# EAGLE schematic quantum_AnalougeEngine_V3_0 (EAGLE 9.5.1)

## Sheet 1 of 10: Interface
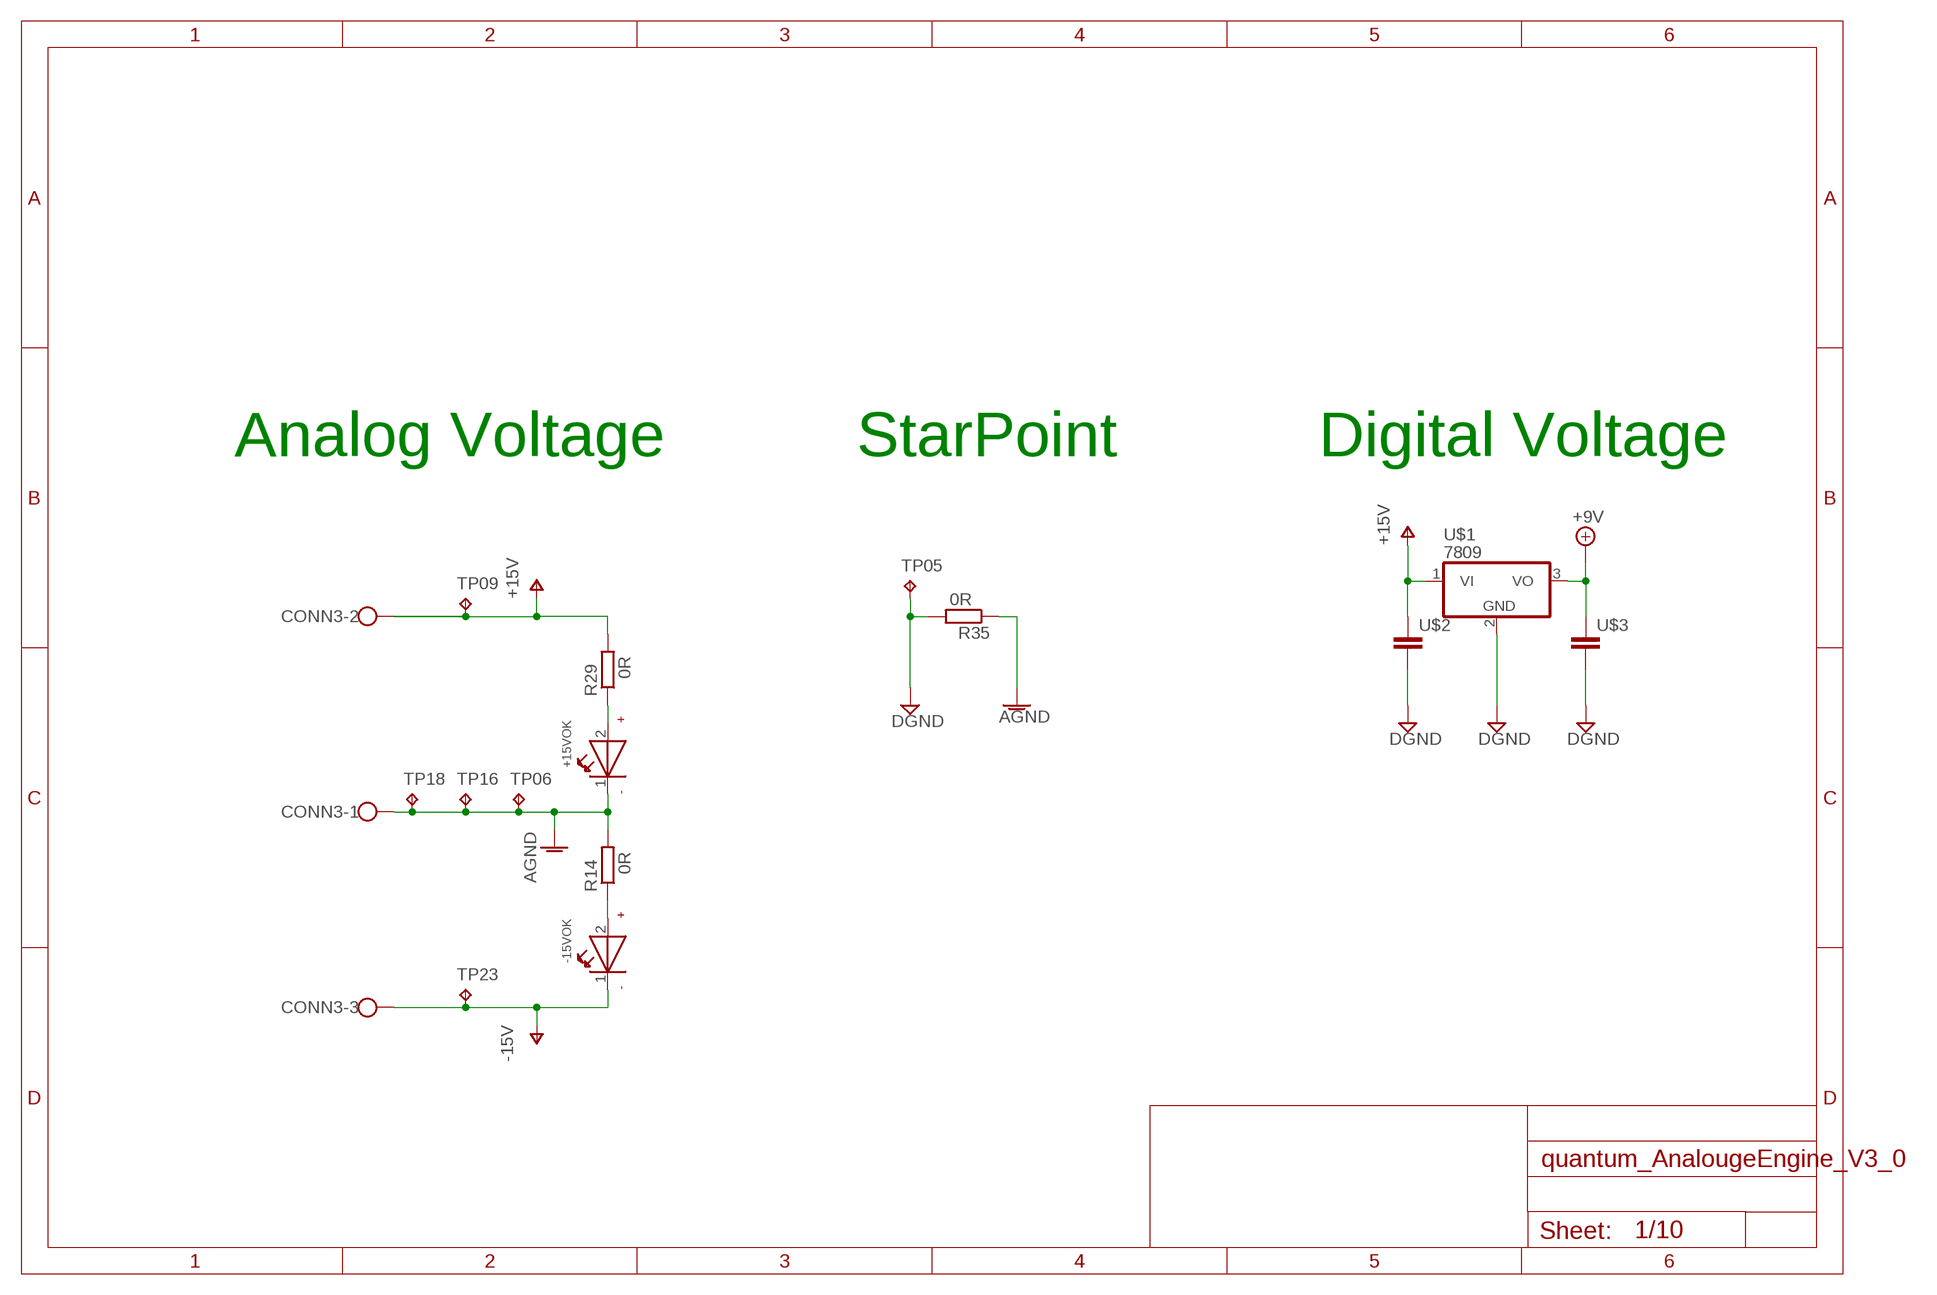
[diagram p0: schematic, sheet 1]

### Parts
+15VOK  SMD_LED_0603  [WL-SMCW_0603]
-15VOK  SMD_LED_0603  [WL-SMCW_0603]
CONN3  SCHRAUBKLEMME_3POL  [W237-103]
R14  0R  RESISTOR"  [R0805]
R29  0R  RESISTOR"  [R0805]
R35  0R  RESISTOR"  [R0805]
TP05  TPTHT  [THT_PIN]
TP06  TPTHT  [THT_PIN]
TP09  TPTHT  [THT_PIN]
TP16  TPTHT  [THT_PIN]
TP18  TPTHT  [THT_PIN]
TP23  TPTHT  [THT_PIN]
U$1  7809  78  [TO252]
U$2  CAPACITOR"  [C0603]
U$3  CAPACITOR"  [C0603]

### Nets
+9V: U$1.3(VO) U$3.1 ; also sheet 2,10
AGND: +15VOK.1(-) CONN3.1 R14.2 R35.1 TP06.P$1(TP) TP16.P$1(TP) TP18.P$1(TP) ; also sheet 3,4,5,6,7,8,9
DGND: R35.2 TP05.P$1(TP) U$1.2(GND) U$2.2 U$3.2 ; also sheet 2,10
N$50: -15VOK.2(+) R14.1
N$52: +15VOK.2(+) R29.1
V+: CONN3.2 R29.2 TP09.P$1(TP) U$1.1(VI) U$2.1 ; supply symbol labelled +15V ; also sheet 3,4,5,6,7,8,9
V-: -15VOK.1(-) CONN3.3 TP23.P$1(TP) ; supply symbol labelled -15V ; also sheet 3,4,5,6,7,8,9

### Notes on the sheet
- Analog Voltage | StarPoint | Digital Voltage

## Sheet 2 of 10: Relais
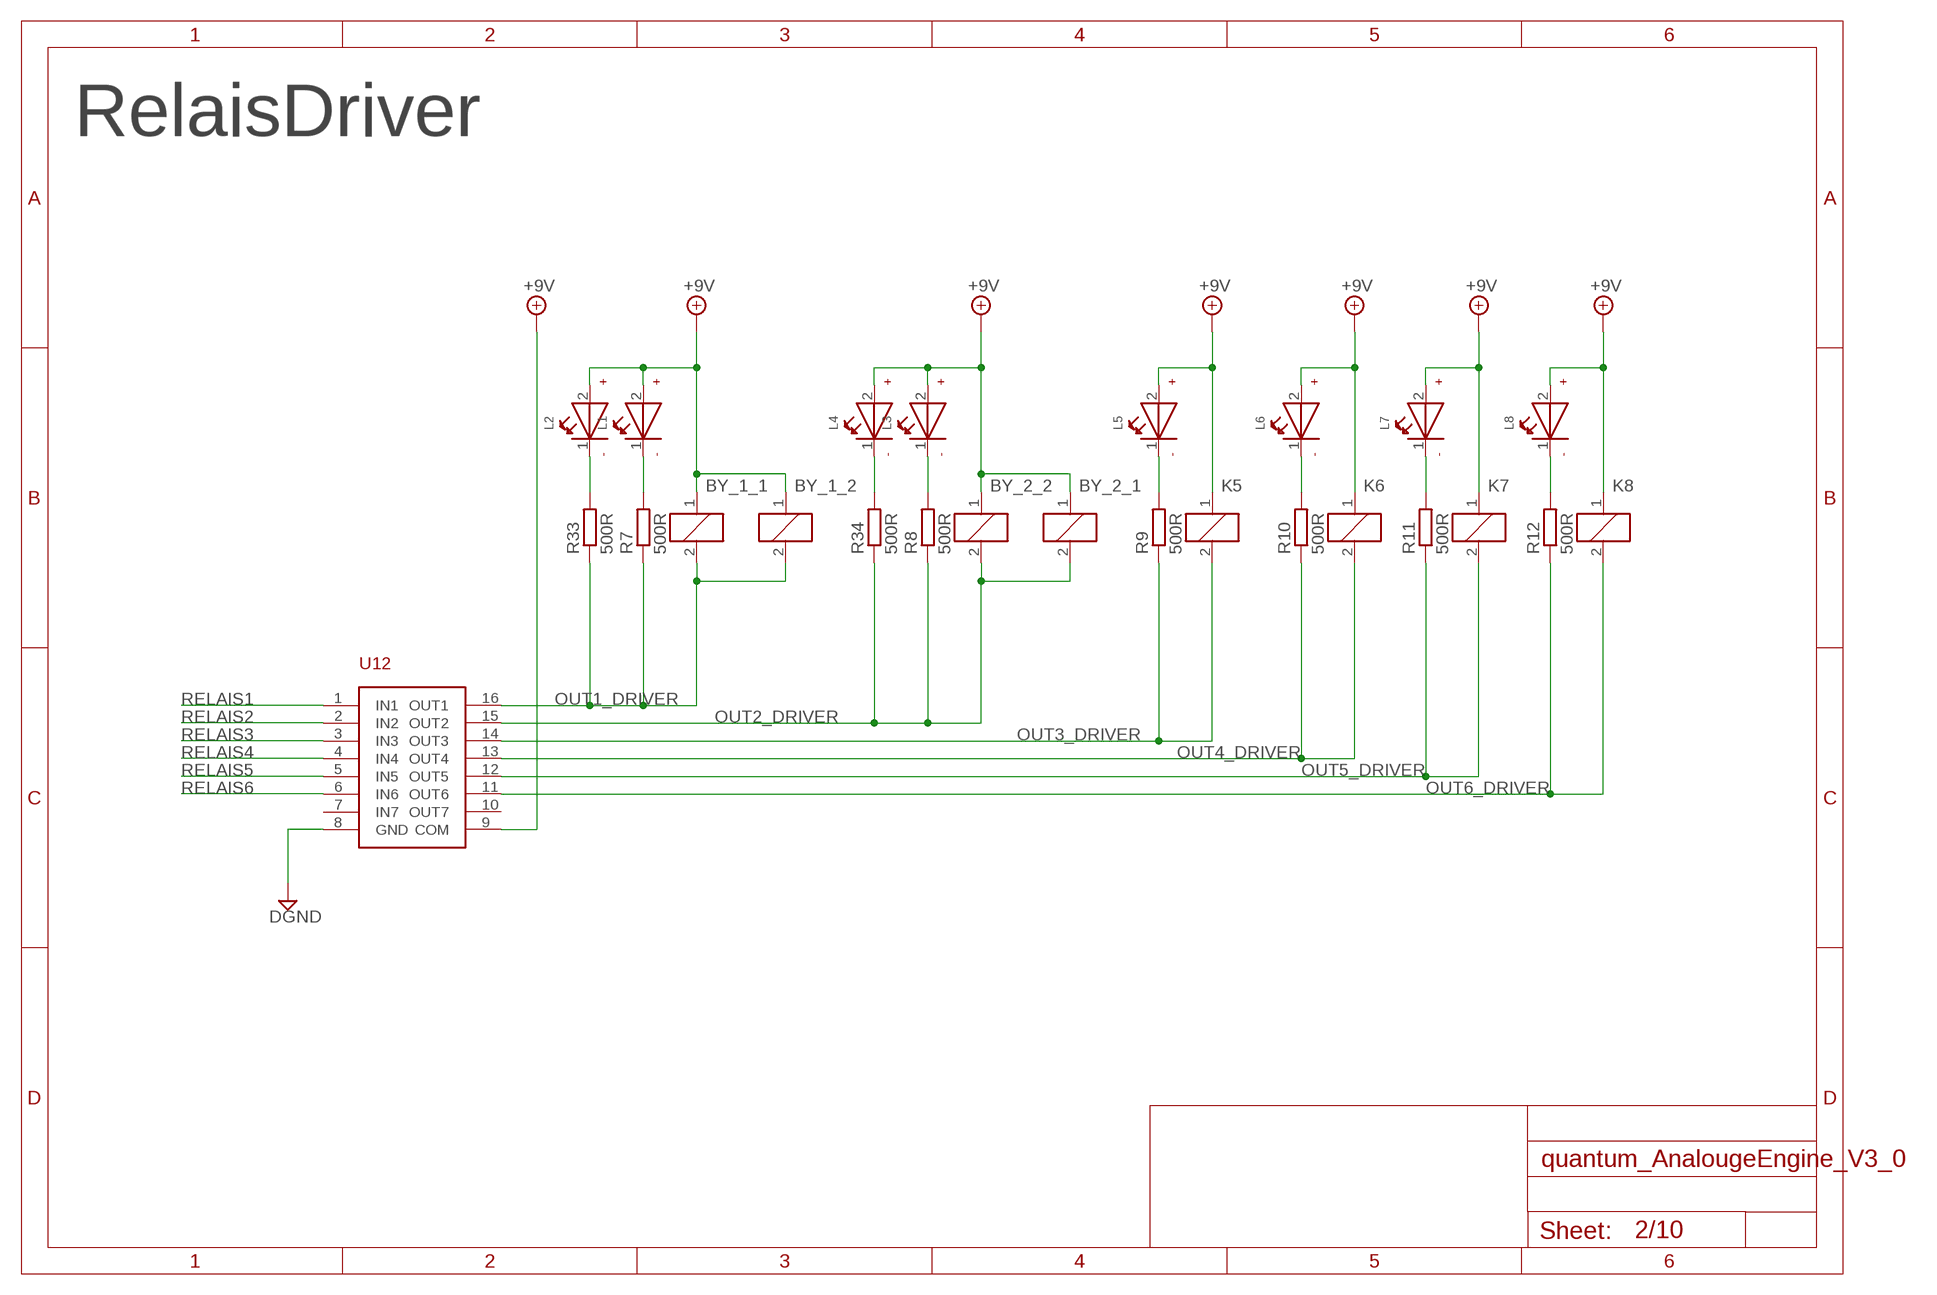
[diagram p1: schematic, sheet 2]

### Parts
BY_1_1  RELAY_EE2-5NU  [351]
BY_1_2  RELAY_EE2-5NU  [351]
BY_2_1  RELAY_EE2-5NU  [351]
BY_2_2  RELAY_EE2-5NU  [351]
K5  RELAY_EE2-5NU  [351]
K6  RELAY_EE2-5NU  [351]
K7  RELAY_EE2-5NU  [351]
K8  RELAY_EE2-5NU  [351]
L1  SMD_LED_0603  [WL-SMCW_0603]
L2  SMD_LED_0603  [WL-SMCW_0603]
L3  SMD_LED_0603  [WL-SMCW_0603]
L4  SMD_LED_0603  [WL-SMCW_0603]
L5  SMD_LED_0603  [WL-SMCW_0603]
L6  SMD_LED_0603  [WL-SMCW_0603]
L7  SMD_LED_0603  [WL-SMCW_0603]
L8  SMD_LED_0603  [WL-SMCW_0603]
R7  500R  RESISTOR"  [R0805]
R8  500R  RESISTOR"  [R0805]
R9  500R  RESISTOR"  [R0805]
R10  500R  RESISTOR"  [R0805]
R11  500R  RESISTOR"  [R0805]
R12  500R  RESISTOR"  [R0805]
R33  500R  RESISTOR"  [R0805]
R34  500R  RESISTOR"  [R0805]
U12  ULN2003  [SOIC16]

### Nets
+9V: BY_1_1.1 BY_1_2.1 BY_2_1.1 BY_2_2.1 K5.1 K6.1 K7.1 K8.1 L1.2(+) L2.2(+) L3.2(+) L4.2(+) L5.2(+) L6.2(+) L7.2(+) L8.2(+) U12.9(COM) ; also sheet 1,10
DGND: U12.8(GND) ; also sheet 1,10
N$14: L1.1(-) R7.2
N$16: L3.1(-) R8.2
N$26: L8.1(-) R12.2
N$29: L7.1(-) R11.2
N$30: L6.1(-) R10.2
N$32: L5.1(-) R9.2
N$49: L2.1(-) R33.2
N$51: L4.1(-) R34.2
OUT1_DRIVER: BY_1_1.2 BY_1_2.2 R7.1 R33.1 U12.16(OUT1)
OUT2_DRIVER: BY_2_1.2 BY_2_2.2 R8.1 R34.1 U12.15(OUT2)
OUT3_DRIVER: K5.2 R9.1 U12.14(OUT3)
OUT4_DRIVER: K6.2 R10.1 U12.13(OUT4)
OUT5_DRIVER: K7.2 R11.1 U12.12(OUT5)
OUT6_DRIVER: K8.2 R12.1 U12.11(OUT6)
RELAIS1: U12.1(IN1) ; also sheet 10
RELAIS2: U12.2(IN2) ; also sheet 10
RELAIS3: U12.3(IN3) ; also sheet 10
RELAIS4: U12.4(IN4) ; also sheet 10
RELAIS5: U12.5(IN5) ; also sheet 10
RELAIS6: U12.6(IN6) ; also sheet 10
Unconnected: U12.7(IN7) U12.10(OUT7)

### Notes on the sheet
- RelaisDriver

## Sheet 3 of 10: MS Decode
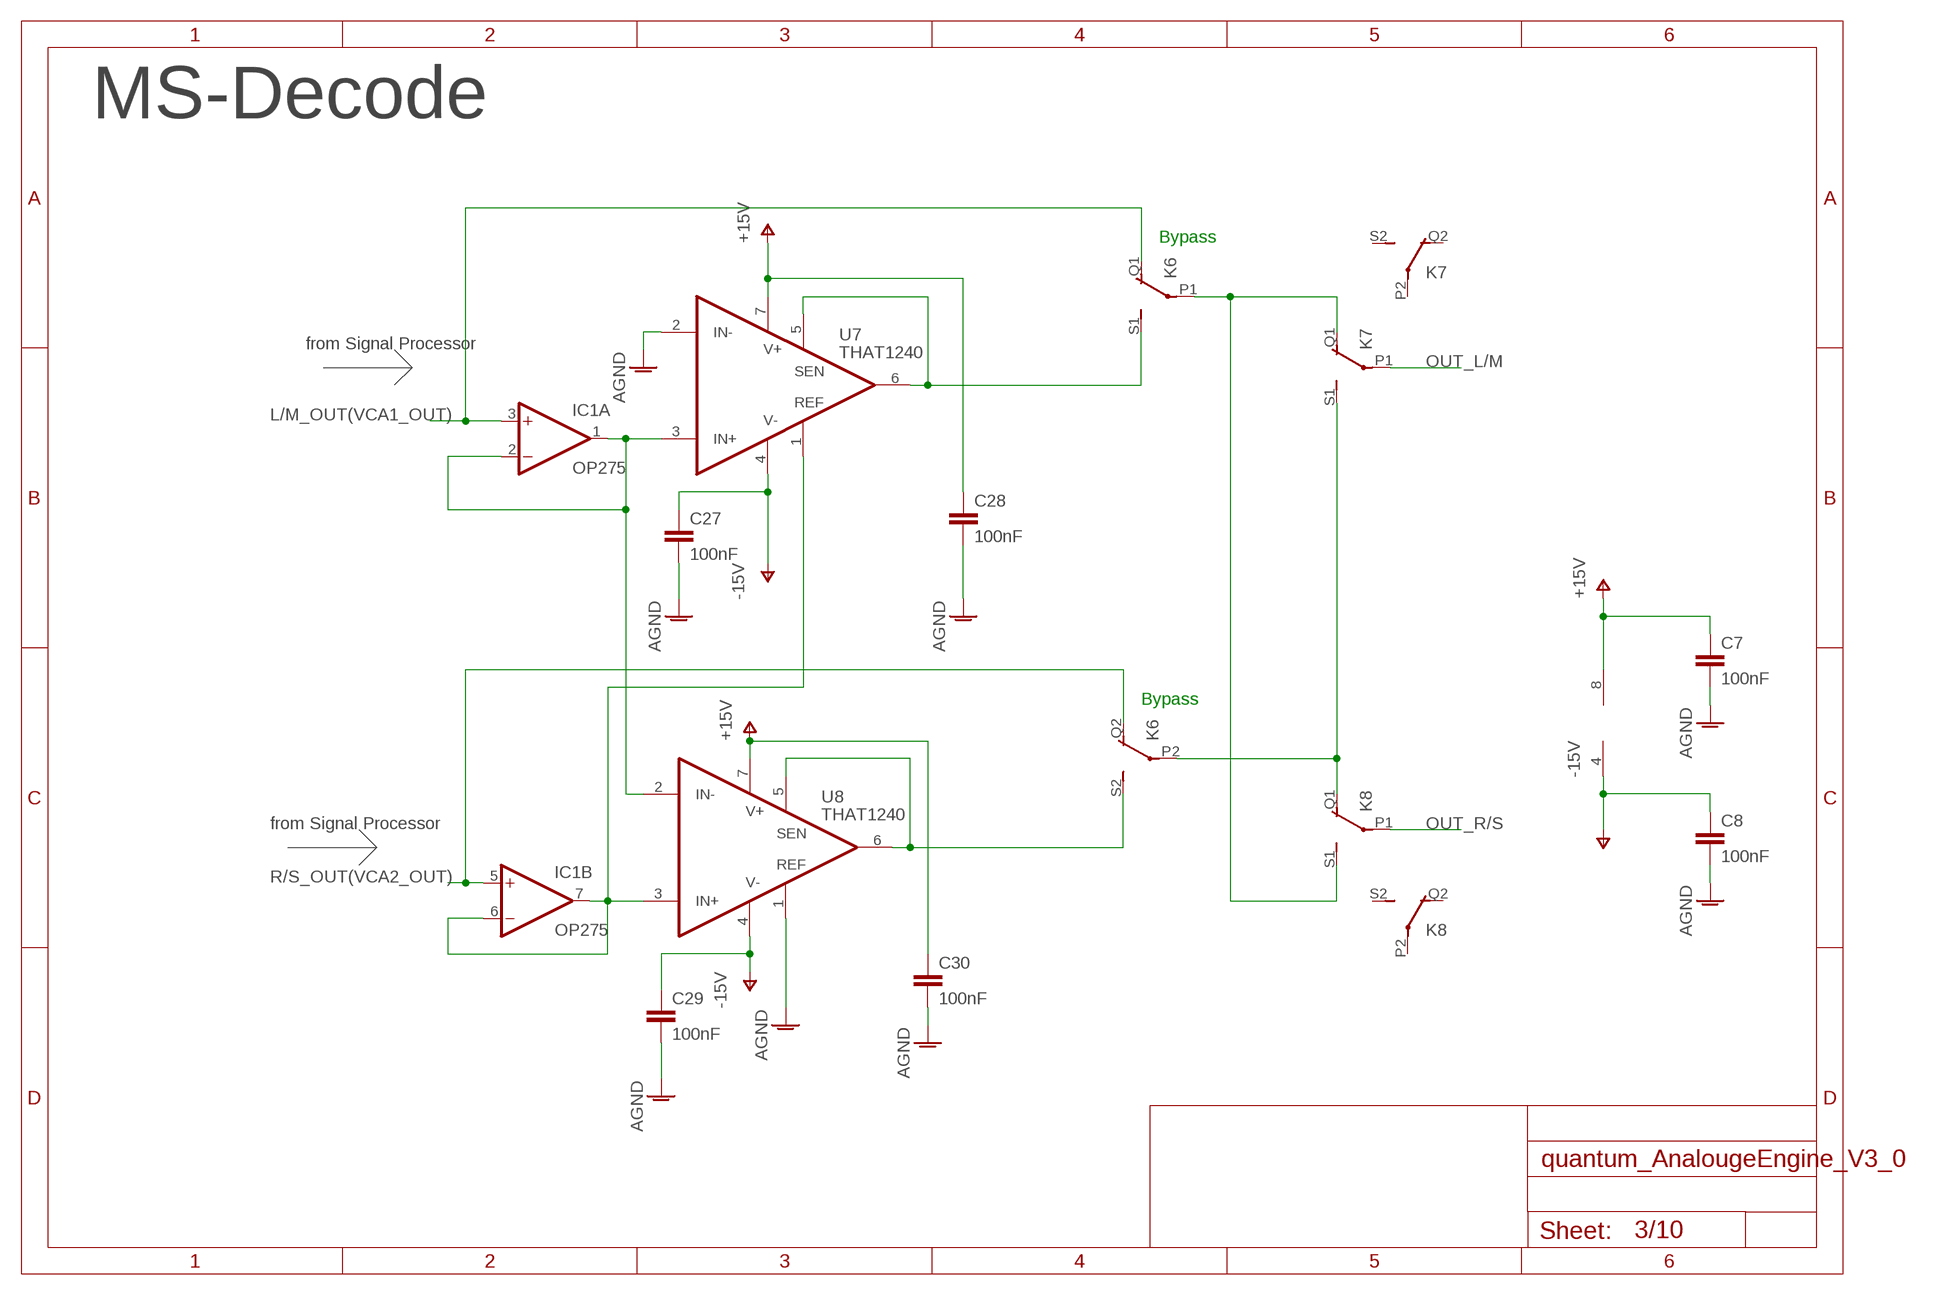
[diagram p2: schematic, sheet 3]

### Parts
C7  100nF  CAPACITOR"  [C0603]
C8  100nF  CAPACITOR"  [C0603]
C27  100nF  CAPACITOR"  [C0603]
C28  100nF  CAPACITOR"  [C0603]
C29  100nF  CAPACITOR"  [C0603]
C30  100nF  CAPACITOR"  [C0603]
IC1  OP275  [SOIC8]
U7  THAT1240  THAT1240SO8-U  [SO08]
U8  THAT1240  THAT1240SO8-U  [SO08]

### Nets
AGND: C7.2 C8.2 C27.2 C28.2 C29.2 C30.2 U7.2(IN-) U8.1(REF) ; also sheet 1,4,5,6,7,8,9
L/M_OUT(VCA1_OUT): IC1.3(A:+IN) K6.Q1(2:O) ; also sheet 7,9
M1: K6.S1(2:S) U7.5(SEN) U7.6(OUT)
N$5: K6.P1(2:P) K7.Q1(2:O) K8.S1(2:S)
N$19: K6.P2(3:P) K7.S1(2:S) K8.Q1(2:O)
N$43: IC1.6(B:-IN) IC1.7(B:OUT) U7.1(REF) U8.3(IN+)
N$45: IC1.1(A:OUT) IC1.2(A:-IN) U7.3(IN+) U8.2(IN-)
OUT_L/M: K7.P1(2:P) ; also sheet 5
OUT_R/S: K8.P1(2:P) ; also sheet 4
R/S_OUT(VCA2_OUT): IC1.5(B:+IN) K6.Q2(3:O) ; also sheet 7,9
S1: K6.S2(3:S) U8.5(SEN) U8.6(OUT)
V+: C7.1 C28.1 C30.1 IC1.8(P:V+) U7.7(V+) U8.7(V+) ; supply symbol labelled +15V ; also sheet 1,4,5,6,7,8,9
V-: C8.1 C27.1 C29.1 IC1.4(P:V-) U7.4(V-) U8.4(V-) ; supply symbol labelled -15V ; also sheet 1,4,5,6,7,8,9
Unconnected: K7.P2(3:P) K7.Q2(3:O) K7.S2(3:S) K8.P2(3:P) K8.Q2(3:O) K8.S2(3:S)

### Notes on the sheet
- MS-Decode
- Bypass
- from Signal Processor
- Bypass
- from Signal Processor

## Sheet 4 of 10: Right I/O Section
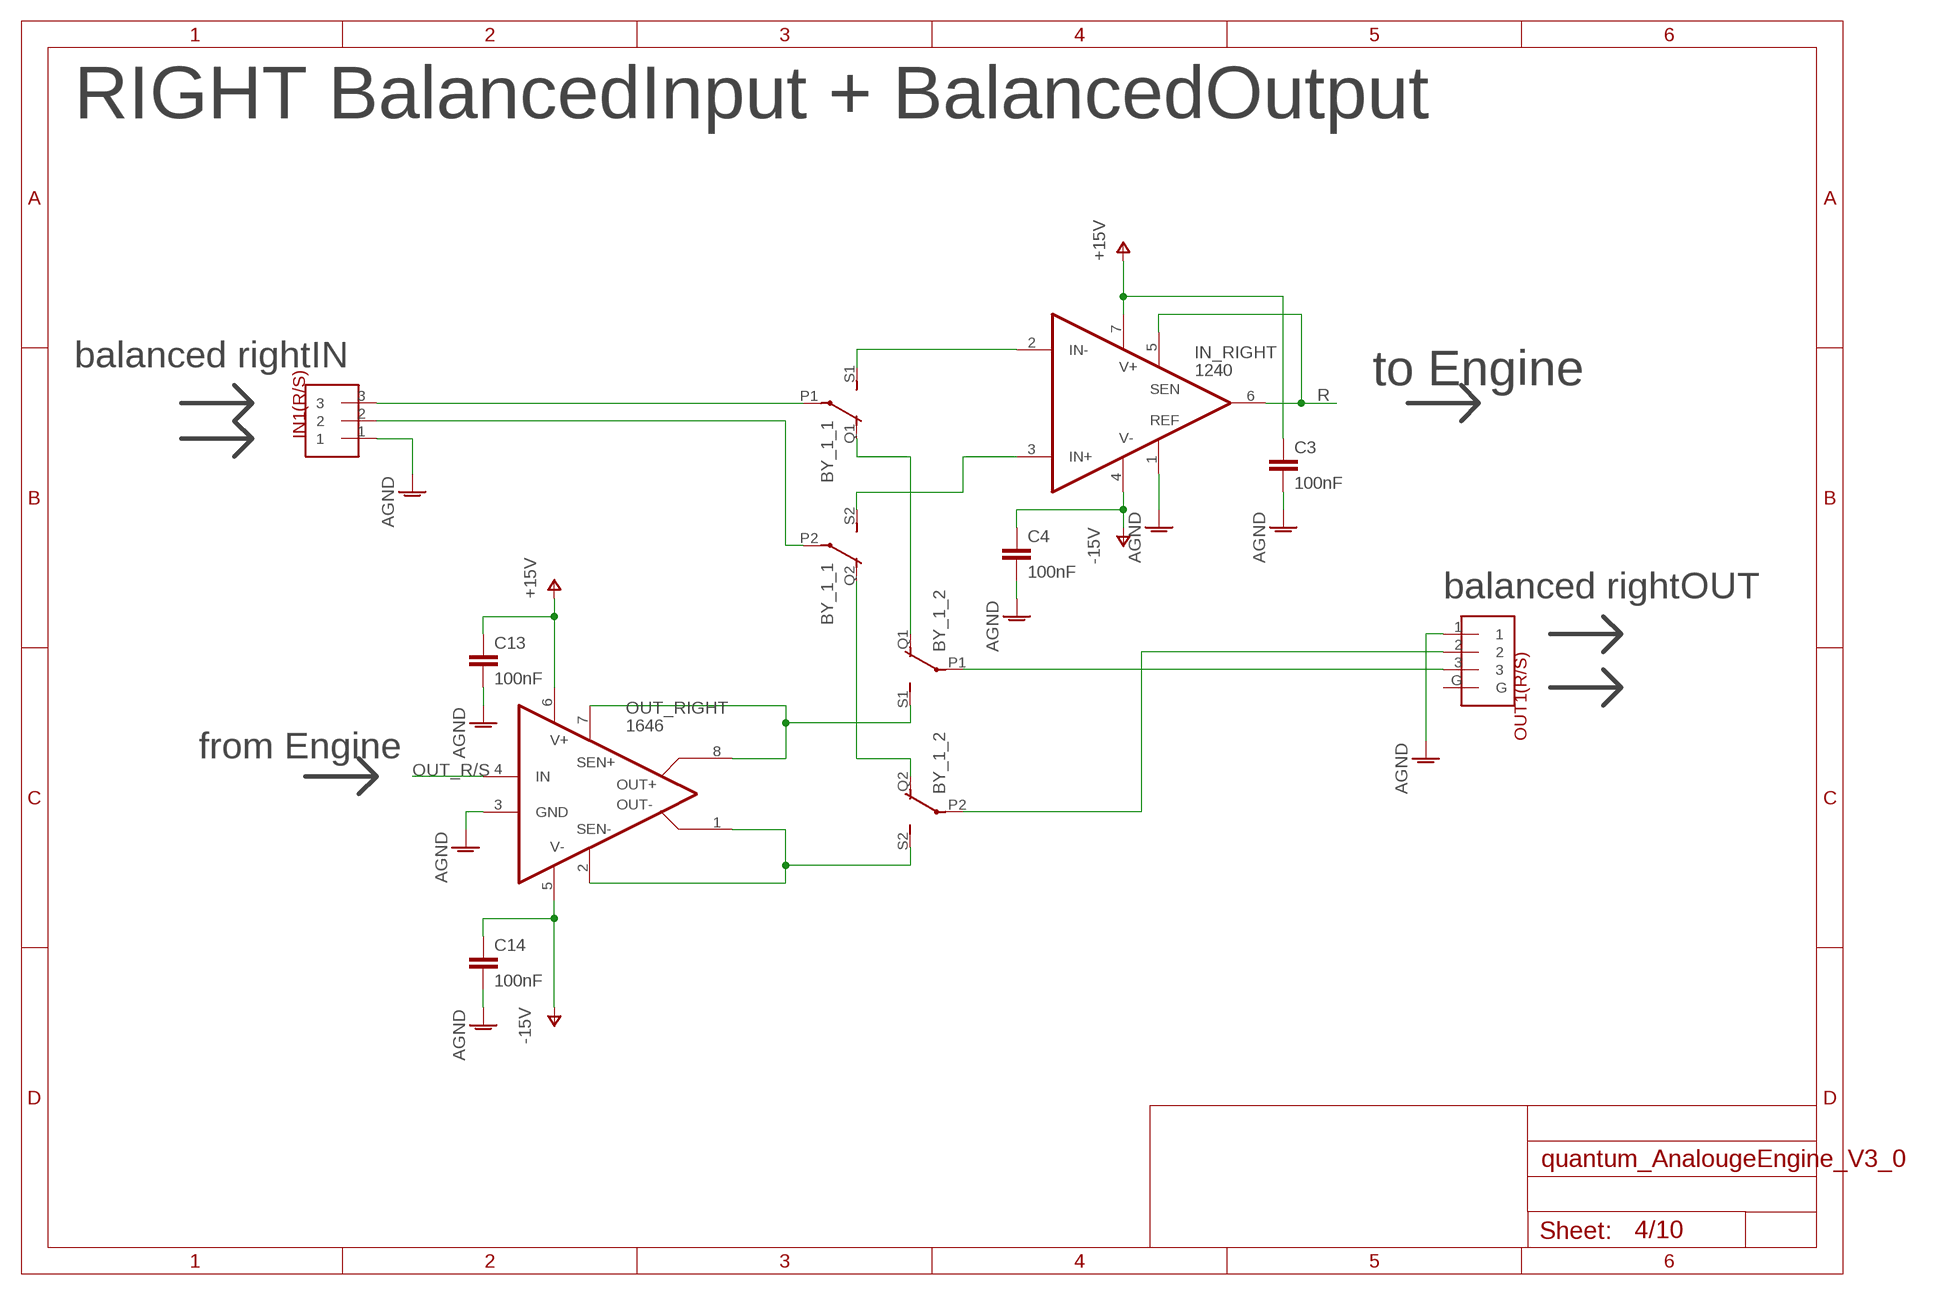
[diagram p3: schematic, sheet 4]

### Parts
C3  100nF  CAPACITOR"  [C0603]
C4  100nF  CAPACITOR"  [C0603]
C13  100nF  CAPACITOR"  [C0603]
C14  100nF  CAPACITOR"  [C0603]
IN1(R/S)  NEUTRIK_NC3FAH  [NEUTRIK_NC3FAH]
IN_RIGHT  1240  THAT1240SO8-U  [SO08]
OUT1(R/S)  NEUTRIK_NC3MAH  [NEUTRIK_NC3MAH]
OUT_RIGHT  1646  THAT1646SO8-U  [SO08]

### Nets
AGND: C3.2 C4.2 C13.2 C14.2 IN1(R/S).1 IN_RIGHT.1(REF) OUT1(R/S).1 OUT_RIGHT.3(GND) ; also sheet 1,3,5,6,7,8,9
N$1: BY_1_1.S1(2:S) IN_RIGHT.2(IN-)
N$2: BY_1_1.S2(3:S) IN_RIGHT.3(IN+)
N$8: BY_1_1.Q1(2:O) BY_1_2.Q1(2:O)
N$11: BY_1_1.Q2(3:O) BY_1_2.Q2(3:O)
N$21: BY_1_1.P2(3:P) IN1(R/S).2
N$22: BY_1_1.P1(2:P) IN1(R/S).3
N$23: BY_1_2.P2(3:P) OUT1(R/S).2
N$24: BY_1_2.P1(2:P) OUT1(R/S).3
OUT_R/S: OUT_RIGHT.4(IN) ; also sheet 3
R: IN_RIGHT.5(SEN) IN_RIGHT.6(OUT) ; also sheet 6
R/S_OUT+: BY_1_2.S1(2:S) OUT_RIGHT.7(SEN+) OUT_RIGHT.8(OUT+)
R/S_OUT-: BY_1_2.S2(3:S) OUT_RIGHT.1(OUT-) OUT_RIGHT.2(SEN-)
V+: C3.1 C13.1 IN_RIGHT.7(V+) OUT_RIGHT.6(V+) ; supply symbol labelled +15V ; also sheet 1,3,5,6,7,8,9
V-: C4.1 C14.1 IN_RIGHT.4(V-) OUT_RIGHT.5(V-) ; supply symbol labelled -15V ; also sheet 1,3,5,6,7,8,9
Unconnected: OUT1(R/S).G

### Notes on the sheet
- RIGHT BalancedInput + BalancedOutput
- balanced rightIN
- to Engine
- balanced rightOUT
- from Engine

## Sheet 5 of 10: Left I/O Section
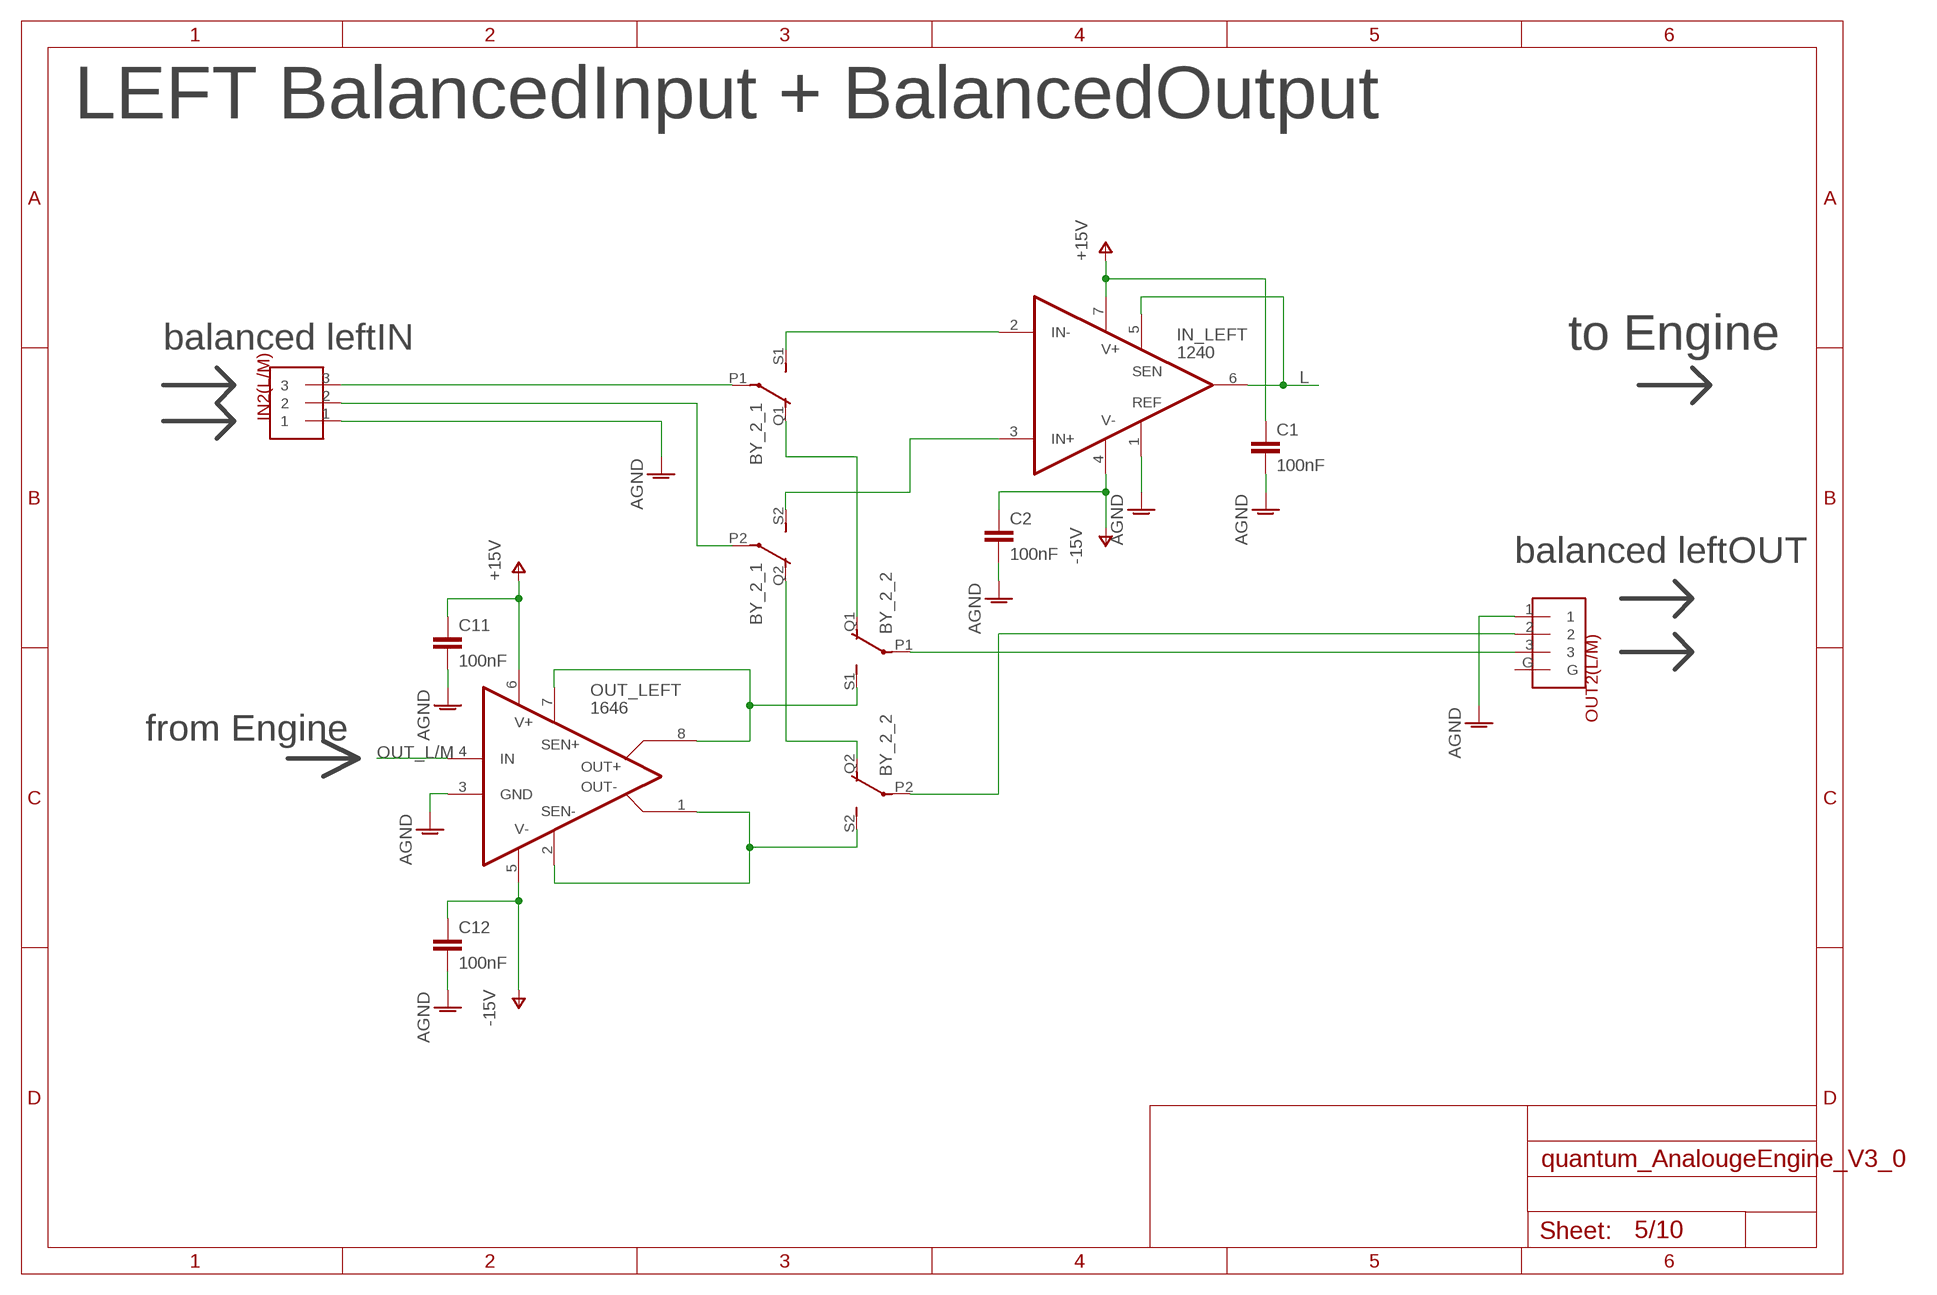
[diagram p4: schematic, sheet 5]

### Parts
C1  100nF  CAPACITOR"  [C0603]
C2  100nF  CAPACITOR"  [C0603]
C11  100nF  CAPACITOR"  [C0603]
C12  100nF  CAPACITOR"  [C0603]
IN2(L/M)  NEUTRIK_NC3FAH  [NEUTRIK_NC3FAH]
IN_LEFT  1240  THAT1240SO8-U  [SO08]
OUT2(L/M)  NEUTRIK_NC3MAH  [NEUTRIK_NC3MAH]
OUT_LEFT  1646  THAT1646SO8-U  [SO08]

### Nets
AGND: C1.2 C2.2 C11.2 C12.2 IN2(L/M).1 IN_LEFT.1(REF) OUT2(L/M).1 OUT_LEFT.3(GND) ; also sheet 1,3,4,6,7,8,9
L: IN_LEFT.5(SEN) IN_LEFT.6(OUT) ; also sheet 6
L/M_OUT+: BY_2_2.S1(2:S) OUT_LEFT.7(SEN+) OUT_LEFT.8(OUT+)
L/M_OUT-: BY_2_2.S2(3:S) OUT_LEFT.1(OUT-) OUT_LEFT.2(SEN-)
N$7: BY_2_1.S2(3:S) IN_LEFT.3(IN+)
N$13: BY_2_1.S1(2:S) IN_LEFT.2(IN-)
N$15: BY_2_2.P1(2:P) OUT2(L/M).3
N$17: BY_2_2.P2(3:P) OUT2(L/M).2
N$25: BY_2_1.P1(2:P) IN2(L/M).3
N$27: BY_2_1.P2(3:P) IN2(L/M).2
N$28: BY_2_1.Q1(2:O) BY_2_2.Q1(2:O)
N$31: BY_2_1.Q2(3:O) BY_2_2.Q2(3:O)
OUT_L/M: OUT_LEFT.4(IN) ; also sheet 3
V+: C1.1 C11.1 IN_LEFT.7(V+) OUT_LEFT.6(V+) ; supply symbol labelled +15V ; also sheet 1,3,4,6,7,8,9
V-: C2.1 C12.1 IN_LEFT.4(V-) OUT_LEFT.5(V-) ; supply symbol labelled -15V ; also sheet 1,3,4,6,7,8,9
Unconnected: OUT2(L/M).G

### Notes on the sheet
- LEFT BalancedInput + BalancedOutput
- balanced leftIN | to Engine
- balanced leftOUT
- from Engine

## Sheet 6 of 10: MS Encode
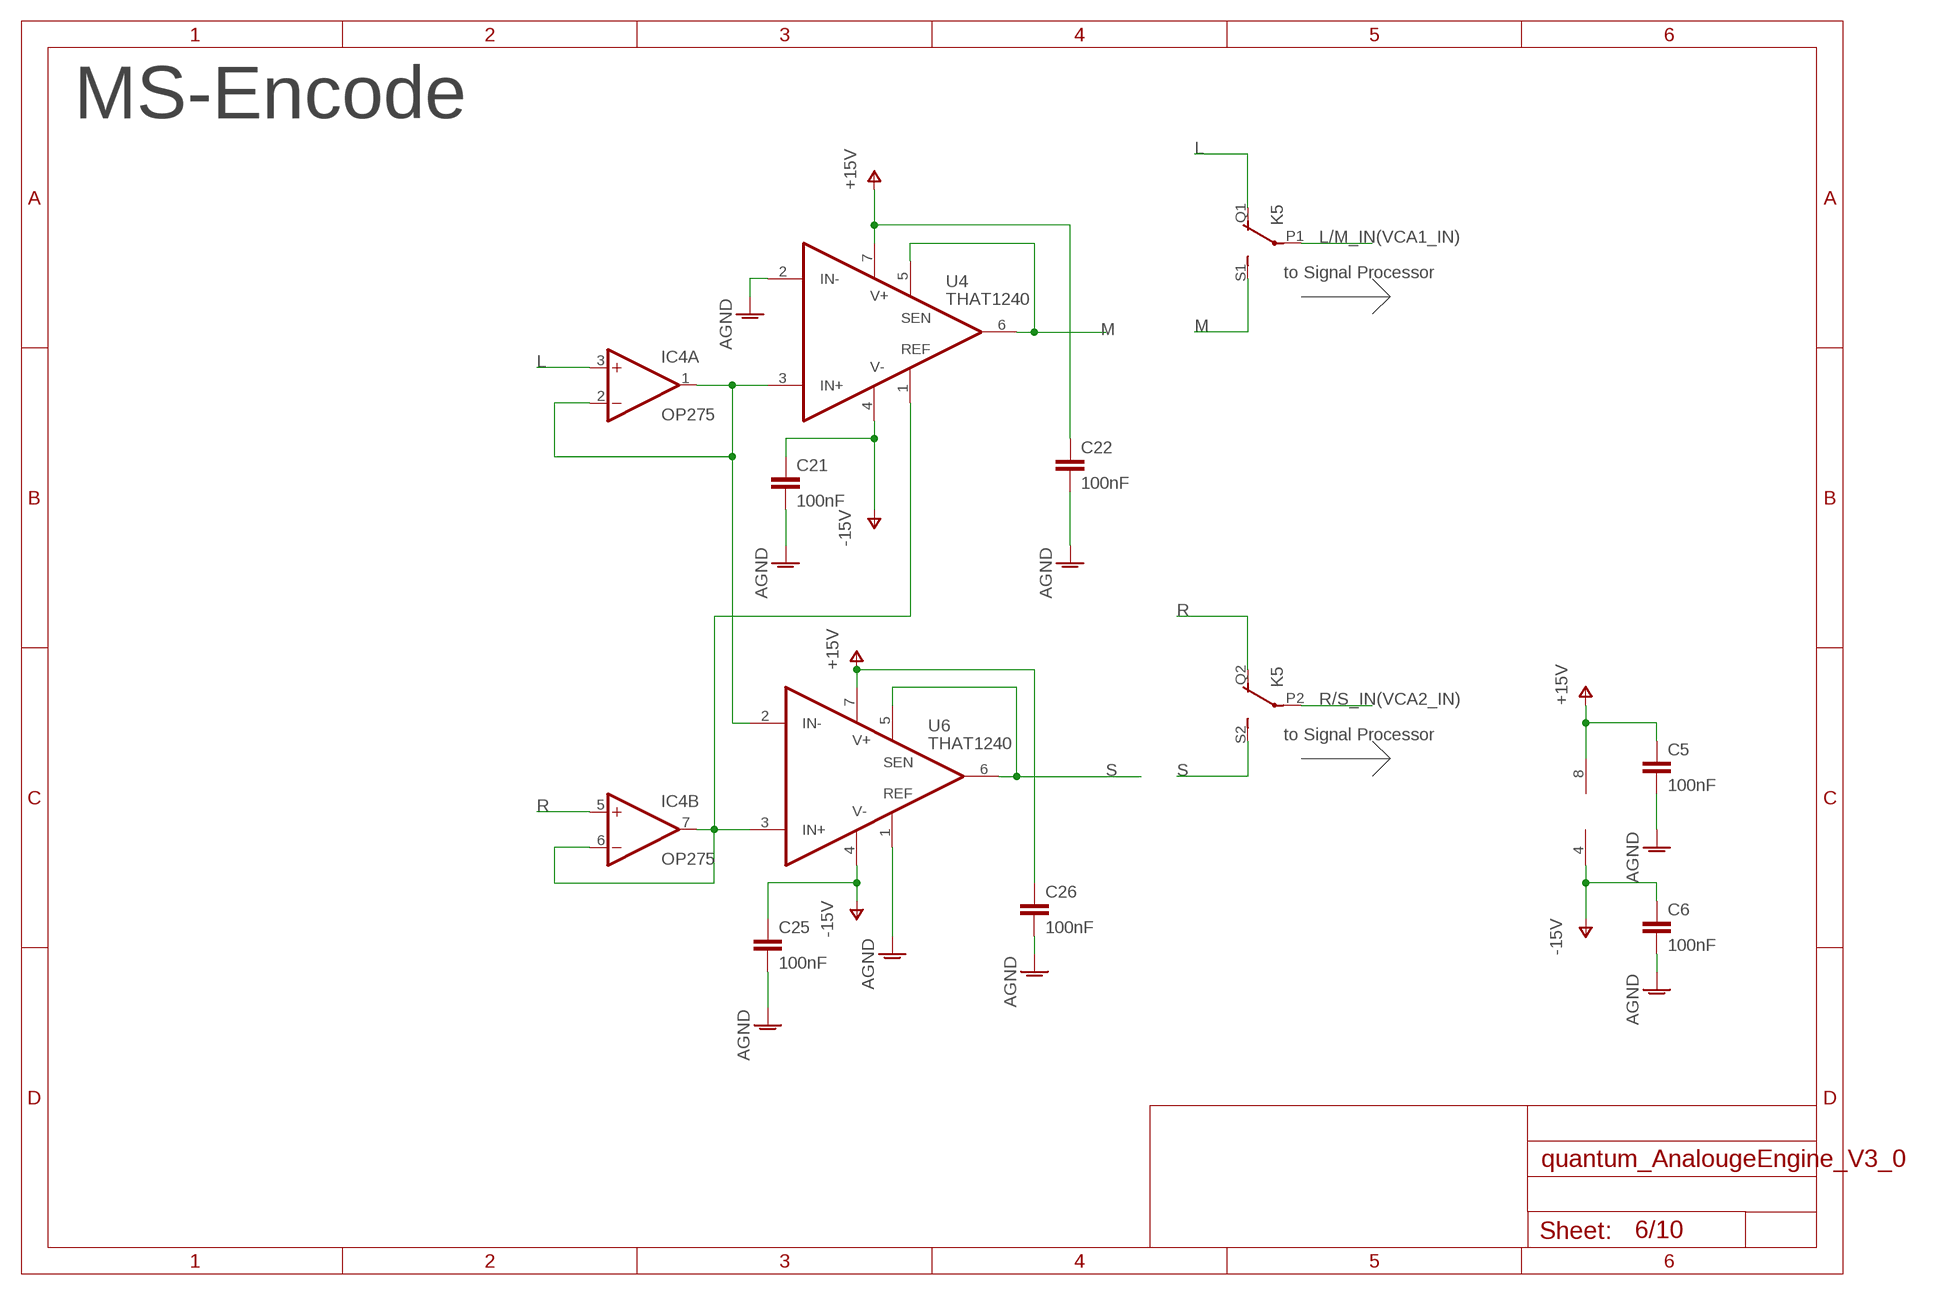
[diagram p5: schematic, sheet 6]

### Parts
C5  100nF  CAPACITOR"  [C0603]
C6  100nF  CAPACITOR"  [C0603]
C21  100nF  CAPACITOR"  [C0603]
C22  100nF  CAPACITOR"  [C0603]
C25  100nF  CAPACITOR"  [C0603]
C26  100nF  CAPACITOR"  [C0603]
IC4  OP275  [SOIC8]
U4  THAT1240  THAT1240SO8-U  [SO08]
U6  THAT1240  THAT1240SO8-U  [SO08]

### Nets
AGND: C5.2 C6.2 C21.2 C22.2 C25.2 C26.2 U4.2(IN-) U6.1(REF) ; also sheet 1,3,4,5,7,8,9
L: IC4.3(A:+IN) K5.Q1(2:O) ; also sheet 5
L/M_IN(VCA1_IN): K5.P1(2:P) ; also sheet 7,8
M: K5.S1(2:S) U4.5(SEN) U4.6(OUT)
N$18: IC4.1(A:OUT) IC4.2(A:-IN) U4.3(IN+) U6.2(IN-)
N$33: IC4.6(B:-IN) IC4.7(B:OUT) U4.1(REF) U6.3(IN+)
R: IC4.5(B:+IN) K5.Q2(3:O) ; also sheet 4
R/S_IN(VCA2_IN): K5.P2(3:P) ; also sheet 7,8
S: K5.S2(3:S) U6.5(SEN) U6.6(OUT)
V+: C5.1 C22.1 C26.1 IC4.8(P:V+) U4.7(V+) U6.7(V+) ; supply symbol labelled +15V ; also sheet 1,3,4,5,7,8,9
V-: C6.1 C21.1 C25.1 IC4.4(P:V-) U4.4(V-) U6.4(V-) ; supply symbol labelled -15V ; also sheet 1,3,4,5,7,8,9

### Notes on the sheet
- MS-Encode
- to Signal Processor
- to Signal Processor

## Sheet 7 of 10: VCA
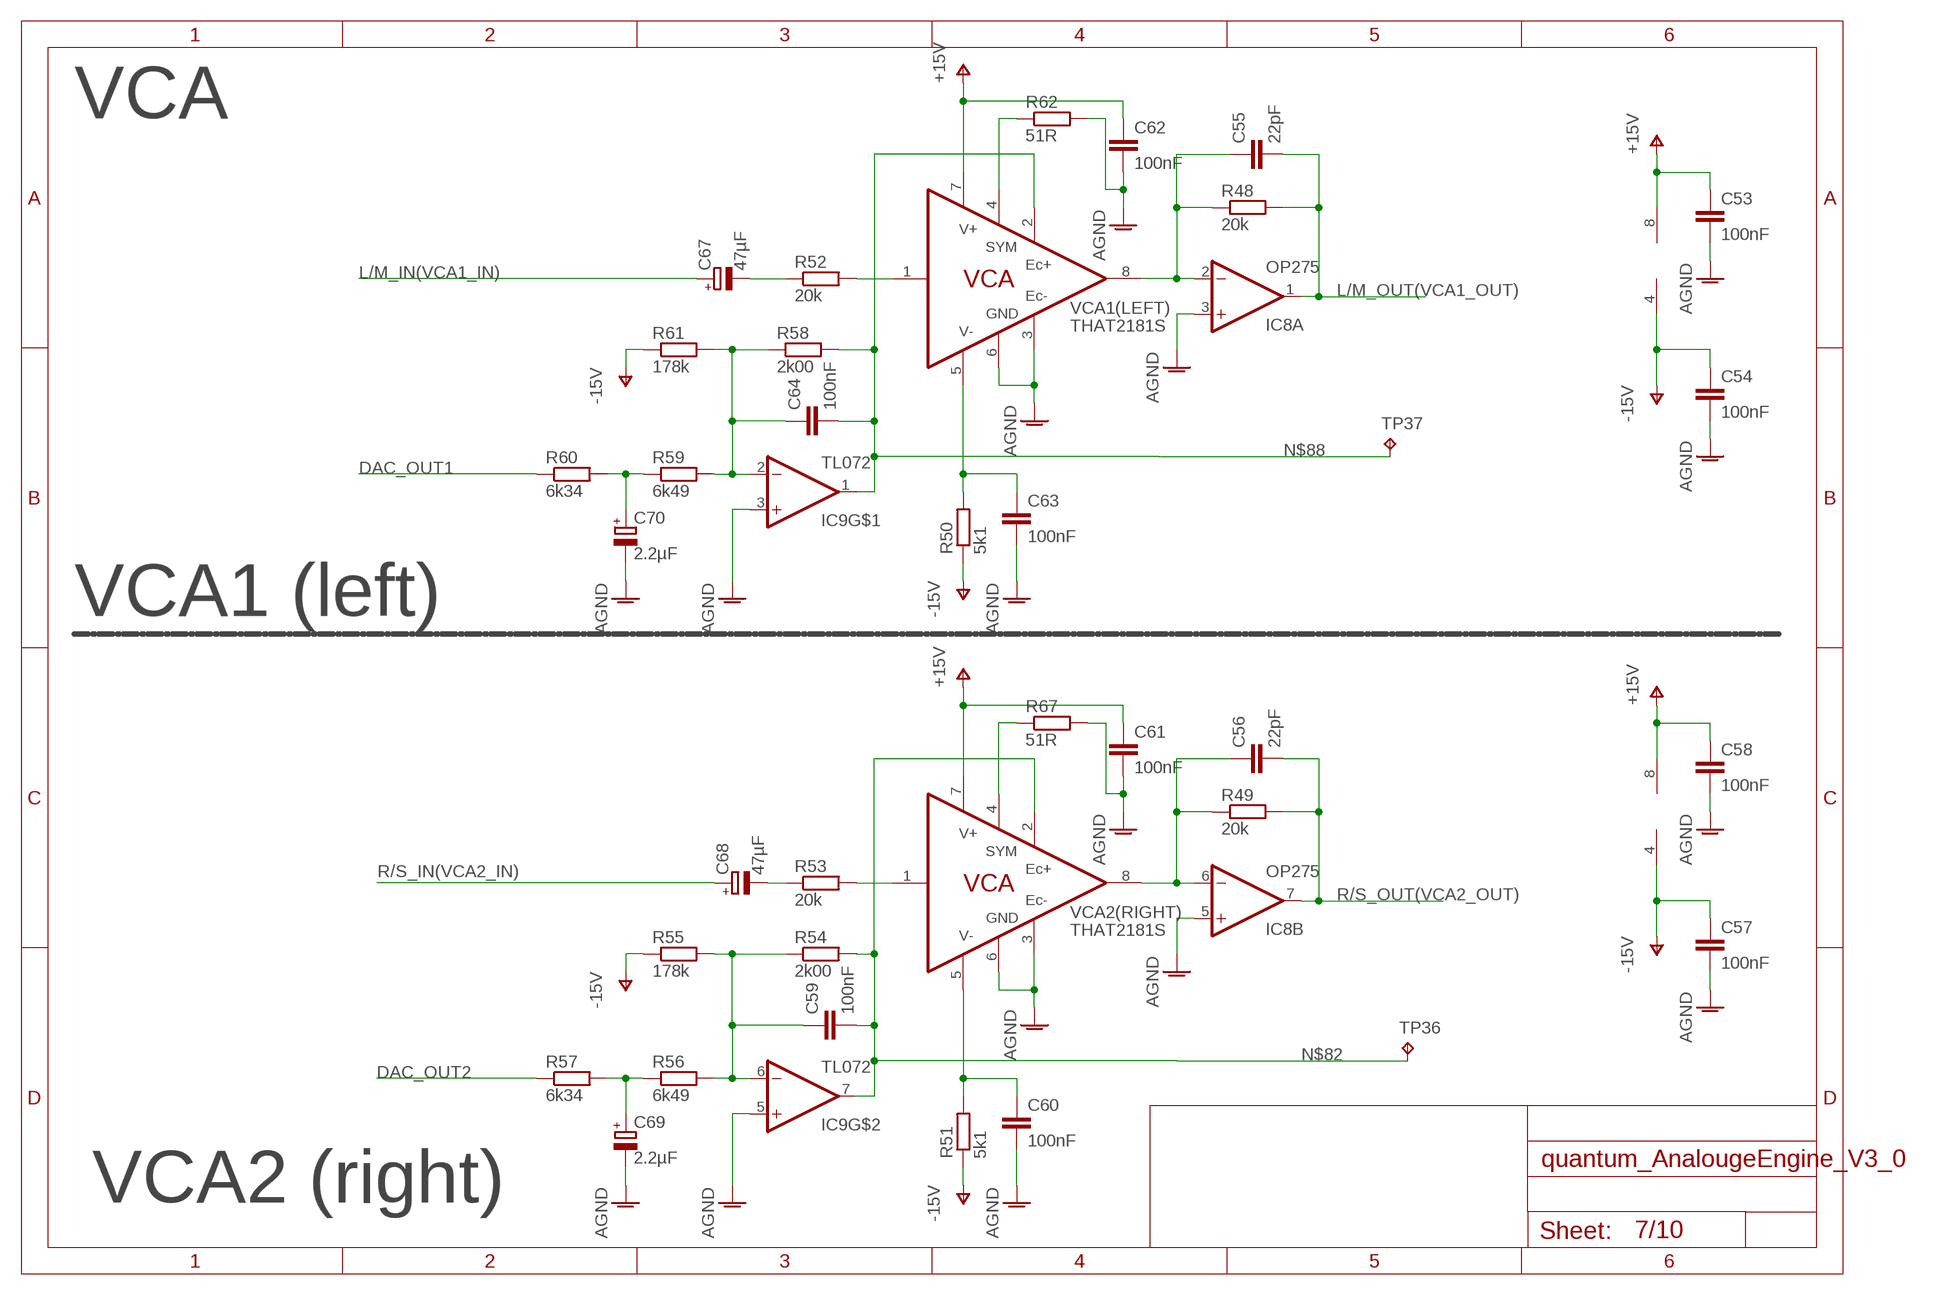
[diagram p6: schematic, sheet 7]

### Parts
C53  100nF  CAPACITOR"  [C0603]
C54  100nF  CAPACITOR"  [C0603]
C55  22pF  CAPACITOR"  [C0603]
C56  22pF  CAPACITOR"  [C0603]
C57  100nF  CAPACITOR"  [C0603]
C58  100nF  CAPACITOR"  [C0603]
C59  100nF  CAPACITOR"  [C0603]
C60  100nF  CAPACITOR"  [C0603]
C61  100nF  CAPACITOR"  [C0603]
C62  100nF  CAPACITOR"  [C0603]
C63  100nF  CAPACITOR"  [C0603]
C64  100nF  CAPACITOR"  [C0603]
C67  47µF  SMD_ELCTROLYTIC  [153CLV-0605]
C68  47µF  SMD_ELCTROLYTIC  [153CLV-0605]
C69  2.2µF  SMD_ELCTROLYTIC  [153CLV-0605]
C70  2.2µF  SMD_ELCTROLYTIC  [153CLV-0605]
IC8  OP275  [SOIC8]
IC9  TL072  [SOIC8]
R48  20k  RESISTOR"  [R0805]
R49  20k  RESISTOR"  [R0805]
R50  5k1  RESISTOR"  [R0805]
R51  5k1  RESISTOR"  [R0805]
R52  20k  RESISTOR"  [R0805]
R53  20k  RESISTOR"  [R0805]
R54  2k00  RESISTOR"  [R0805]
R55  178k  RESISTOR"  [R0805]
R56  6k49  RESISTOR"  [R0805]
R57  6k34  RESISTOR"  [R0805]
R58  2k00  RESISTOR"  [R0805]
R59  6k49  RESISTOR"  [R0805]
R60  6k34  RESISTOR"  [R0805]
R61  178k  RESISTOR"  [R0805]
R62  51R  RESISTOR"  [R0805]
R67  51R  RESISTOR"  [R0805]
TP36  TPTHT  [THT_PIN]
TP37  TPTHT  [THT_PIN]
VCA1(LEFT)  THAT2181S  [SO08]
VCA2(RIGHT)  THAT2181S  [SO08]

### Nets
AGND: C53.2 C54.2 C57.2 C58.2 C60.2 C61.2 C62.2 C63.2 C69.- C70.- IC8.3(A:+IN) IC8.5(B:+IN) IC9.3(+IN) IC9.5(+IN) R62.2 R67.2 VCA1(LEFT).3(EC-) VCA1(LEFT).6(GND) VCA2(RIGHT).3(EC-) VCA2(RIGHT).6(GND) ; also sheet 1,3,4,5,6,8,9
DAC_OUT1: R60.1 ; also sheet 10
DAC_OUT2: R57.1 ; also sheet 10
L/M_IN(VCA1_IN): C67.+ ; also sheet 6,8
L/M_OUT(VCA1_OUT): C55.2 IC8.1(A:OUT) R48.2 ; also sheet 3,9
N$64: C55.1 IC8.2(A:-IN) R48.1 VCA1(LEFT).8(OUT)
N$65: R52.2 VCA1(LEFT).1(IN)
N$71: C67.- R52.1
N$72: C70.+ R59.1 R60.2
N$75: C56.1 IC8.6(B:-IN) R49.1 VCA2(RIGHT).8(OUT)
N$77: C60.1 R51.2 VCA2(RIGHT).5(V-)
N$78: C68.- R53.1
N$79: R53.2 VCA2(RIGHT).1(IN)
N$80: C63.1 R50.2 VCA1(LEFT).5(V-)
N$81: C59.1 IC9.6(-IN) R54.1 R55.2 R56.2
N$82: C59.2 IC9.7(OUT) R54.2 TP36.P$1(TP) VCA2(RIGHT).2(EC+)
N$84: C64.1 IC9.2(-IN) R58.1 R59.2 R61.2
N$85: C69.+ R56.1 R57.2
N$87: R62.1 VCA1(LEFT).4(SYM)
N$88: C64.2 IC9.1(OUT) R58.2 TP37.P$1(TP) VCA1(LEFT).2(EC+)
N$95: R67.1 VCA2(RIGHT).4(SYM)
R/S_IN(VCA2_IN): C68.+ ; also sheet 6,8
R/S_OUT(VCA2_OUT): C56.2 IC8.7(B:OUT) R49.2 ; also sheet 3,9
V+: C53.1 C58.1 C61.1 C62.1 IC8.8(P:V+) IC9.8(V+) VCA1(LEFT).7(V+) VCA2(RIGHT).7(V+) ; supply symbol labelled +15V ; also sheet 1,3,4,5,6,8,9
V-: C54.1 C57.1 IC8.4(P:V-) IC9.4(V-) R50.1 R51.1 R55.1 R61.1 ; supply symbol labelled -15V ; also sheet 1,3,4,5,6,8,9

### Notes on the sheet
- VCA
- VCA1 (left)
- VCA2 (right)

## Sheet 8 of 10: Signalconditioning INPUT
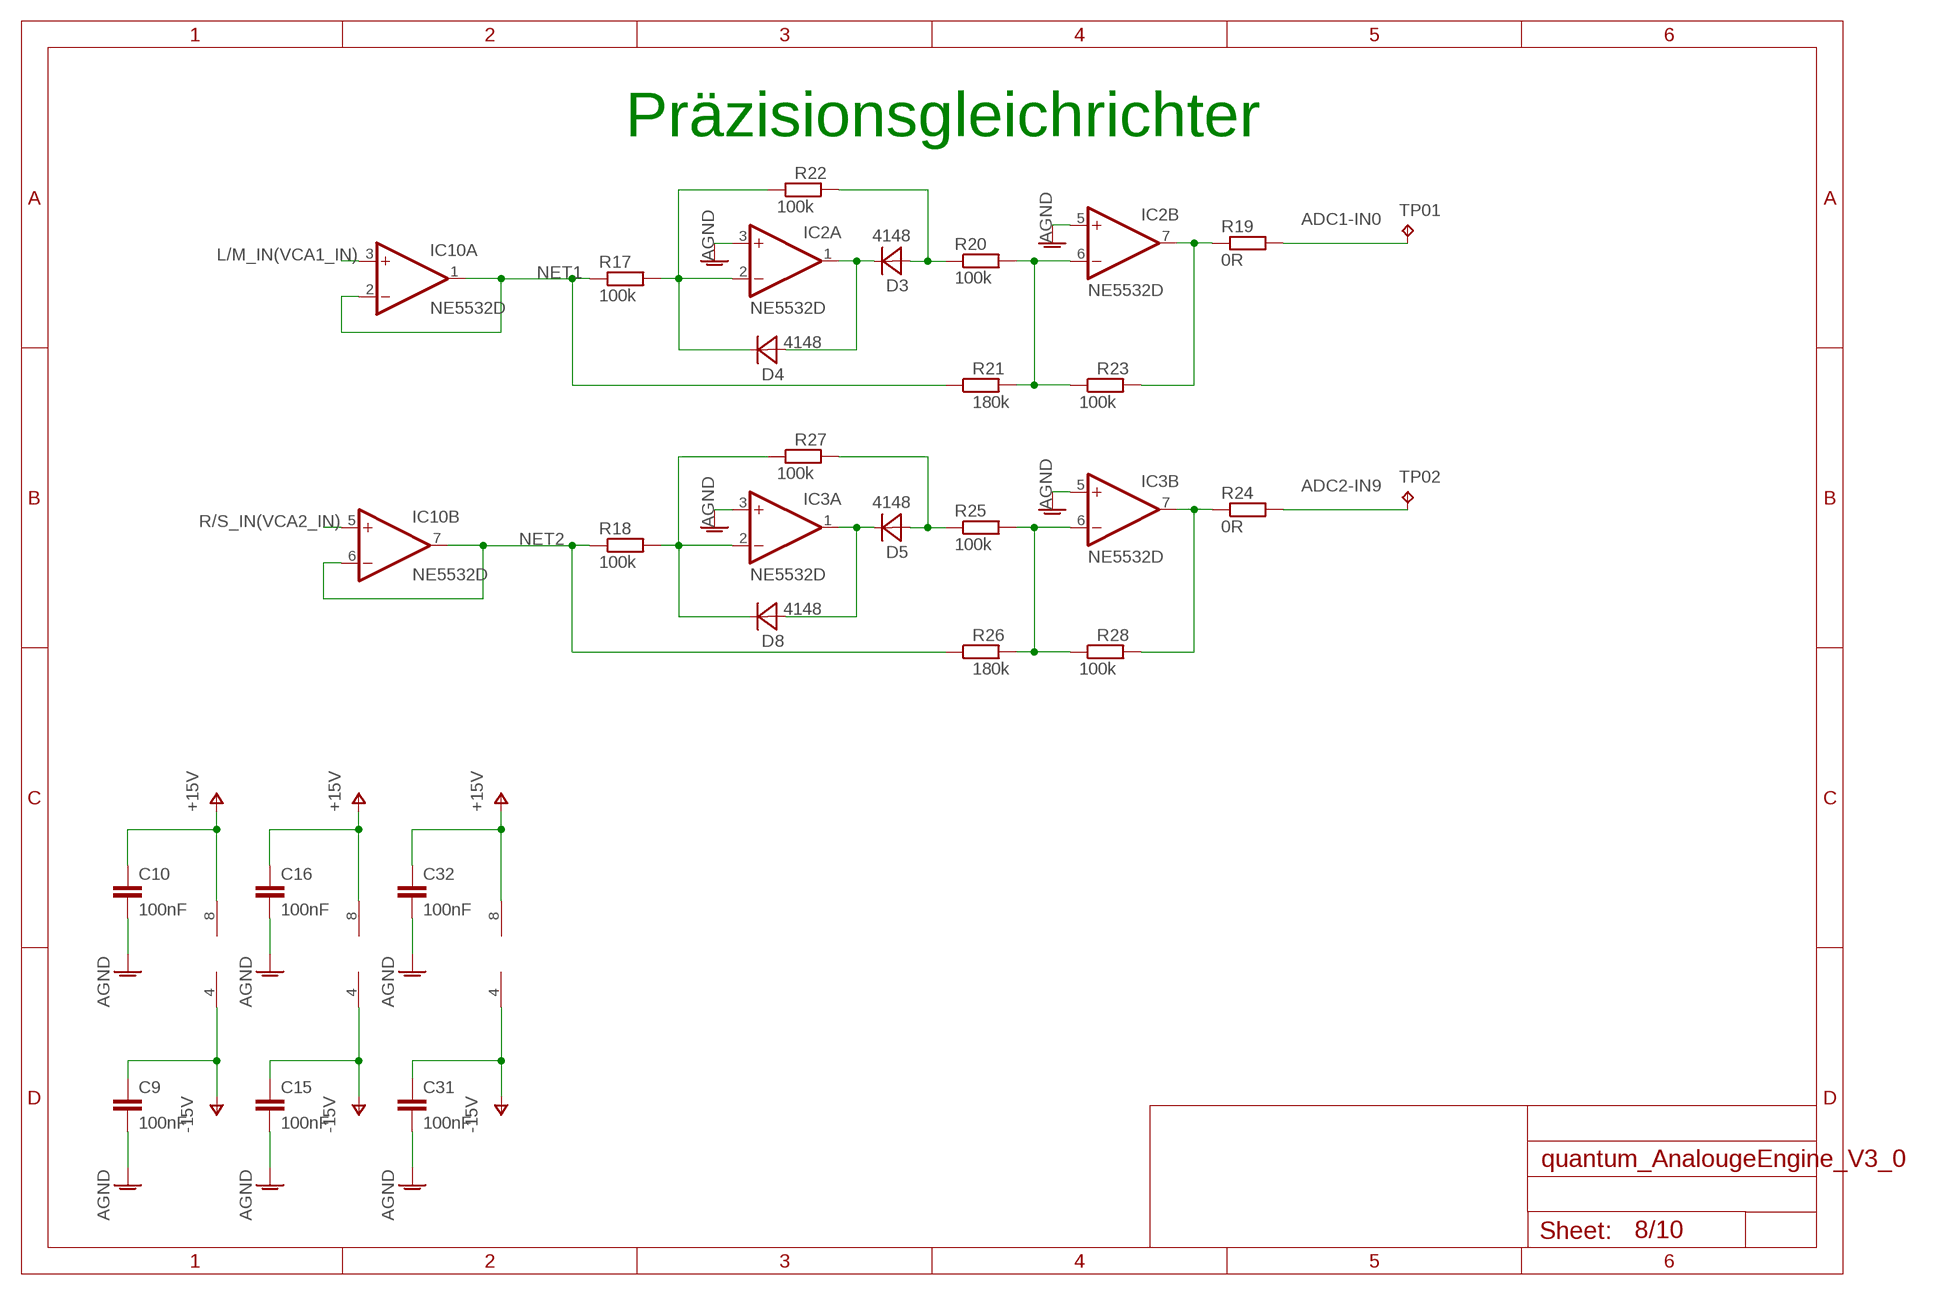
[diagram p7: schematic, sheet 8]

### Parts
C9  100nF  CAPACITOR"  [C0603]
C10  100nF  CAPACITOR"  [C0603]
C15  100nF  CAPACITOR"  [C0603]
C16  100nF  CAPACITOR"  [C0603]
C31  100nF  CAPACITOR"  [C0603]
C32  100nF  CAPACITOR"  [C0603]
D3  4148  [SOD323-R]
D4  4148  [SOD323-R]
D5  4148  [SOD323-R]
D8  4148  [SOD323-R]
IC2  NE5532D  [SO08]
IC3  NE5532D  [SO08]
IC10  NE5532D  [SO08]
R17  100k  RESISTOR"  [R0805]
R18  100k  RESISTOR"  [R0805]
R19  0R  RESISTOR"  [R0805]
R20  100k  RESISTOR"  [R0805]
R21  180k  RESISTOR"  [R0805]
R22  100k  RESISTOR"  [R0805]
R23  100k  RESISTOR"  [R0805]
R24  0R  RESISTOR"  [R0805]
R25  100k  RESISTOR"  [R0805]
R26  180k  RESISTOR"  [R0805]
R27  100k  RESISTOR"  [R0805]
R28  100k  RESISTOR"  [R0805]
TP01  TPTHT  [THT_PIN]
TP02  TPTHT  [THT_PIN]

### Nets
ADC1-IN0: R19.2 TP01.P$1(TP) ; also sheet 10
ADC2-IN9: R24.2 TP02.P$1(TP) ; also sheet 10
AGND: C9.2 C10.2 C15.2 C16.2 C31.2 C32.2 IC2.3(A:+IN) IC2.5(B:+IN) IC3.3(A:+IN) IC3.5(B:+IN) ; also sheet 1,3,4,5,6,7,9
L/M_IN(VCA1_IN): IC10.3(A:+IN) ; also sheet 6,7
N$3: D4.C IC2.2(A:-IN) R17.2 R22.1
N$4: D3.C D4.A IC2.1(A:OUT)
N$10: D3.A R20.1 R22.2
N$20: IC2.6(B:-IN) R20.2 R21.2 R23.1
N$35: IC2.7(B:OUT) R19.1 R23.2
N$37: D8.C IC3.2(A:-IN) R18.2 R27.1
N$38: D5.C D8.A IC3.1(A:OUT)
N$39: D5.A R25.1 R27.2
N$40: IC3.6(B:-IN) R25.2 R26.2 R28.1
N$41: IC3.7(B:OUT) R24.1 R28.2
NET1: IC10.1(A:OUT) IC10.2(A:-IN) R17.1 R21.1
NET2: IC10.6(B:-IN) IC10.7(B:OUT) R18.1 R26.1
R/S_IN(VCA2_IN): IC10.5(B:+IN) ; also sheet 6,7
V+: C10.1 C16.1 C32.1 IC2.8(P:V+) IC3.8(P:V+) IC10.8(P:V+) ; supply symbol labelled +15V ; also sheet 1,3,4,5,6,7,9
V-: C9.1 C15.1 C31.1 IC2.4(P:V-) IC3.4(P:V-) IC10.4(P:V-) ; supply symbol labelled -15V ; also sheet 1,3,4,5,6,7,9

### Notes on the sheet
- Präzisionsgleichrichter

## Sheet 9 of 10: Signalconditioning OUTPUT
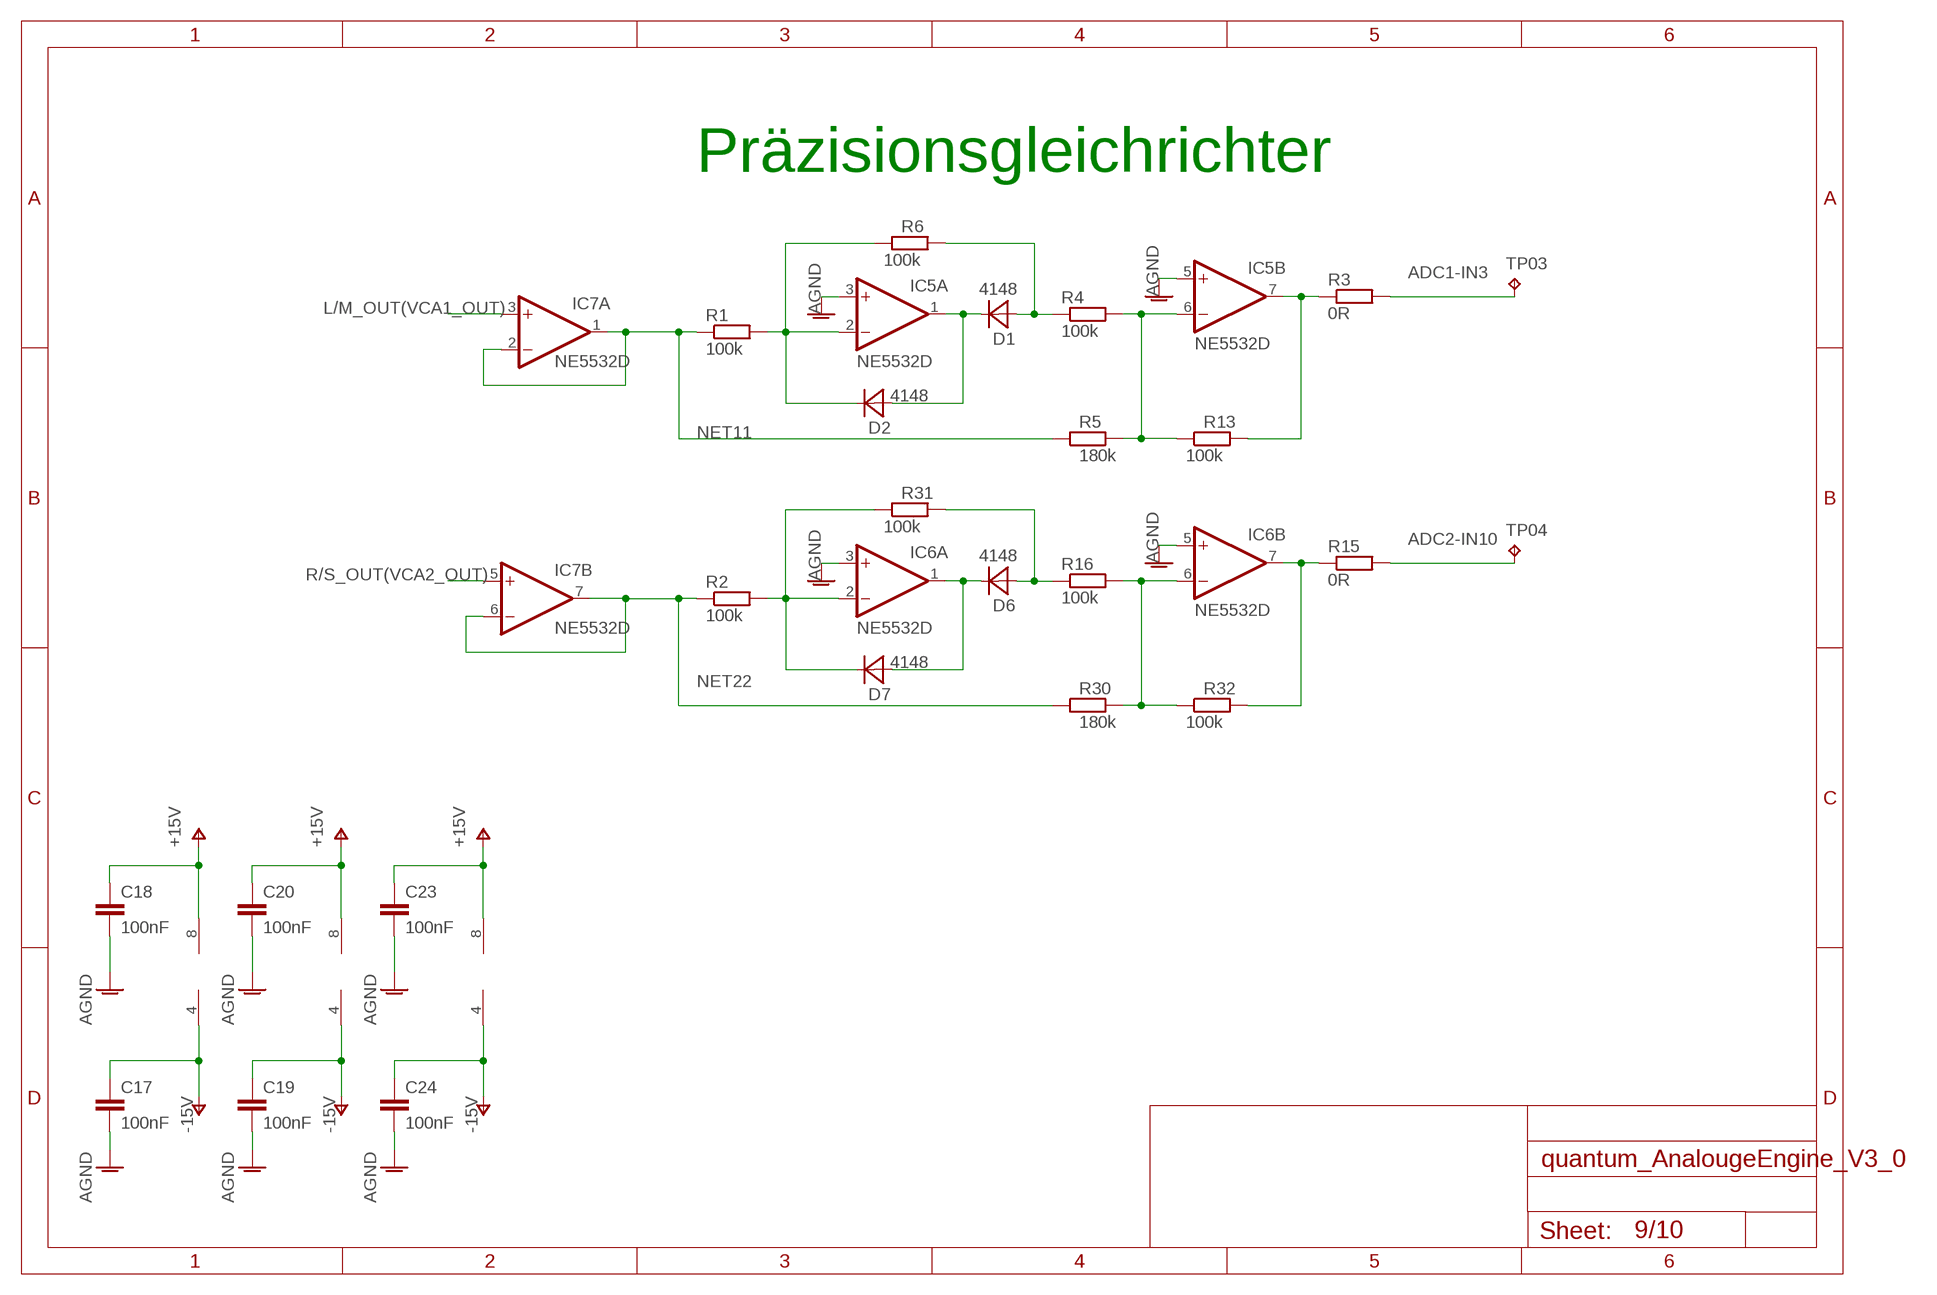
[diagram p8: schematic, sheet 9]

### Parts
C17  100nF  CAPACITOR"  [C0603]
C18  100nF  CAPACITOR"  [C0603]
C19  100nF  CAPACITOR"  [C0603]
C20  100nF  CAPACITOR"  [C0603]
C23  100nF  CAPACITOR"  [C0603]
C24  100nF  CAPACITOR"  [C0603]
D1  4148  [SOD323-R]
D2  4148  [SOD323-R]
D6  4148  [SOD323-R]
D7  4148  [SOD323-R]
IC5  NE5532D  [SO08]
IC6  NE5532D  [SO08]
IC7  NE5532D  [SO08]
R1  100k  RESISTOR"  [R0805]
R2  100k  RESISTOR"  [R0805]
R3  0R  RESISTOR"  [R0805]
R4  100k  RESISTOR"  [R0805]
R5  180k  RESISTOR"  [R0805]
R6  100k  RESISTOR"  [R0805]
R13  100k  RESISTOR"  [R0805]
R15  0R  RESISTOR"  [R0805]
R16  100k  RESISTOR"  [R0805]
R30  180k  RESISTOR"  [R0805]
R31  100k  RESISTOR"  [R0805]
R32  100k  RESISTOR"  [R0805]
TP03  TPTHT  [THT_PIN]
TP04  TPTHT  [THT_PIN]

### Nets
ADC1-IN3: R3.2 TP03.P$1(TP) ; also sheet 10
ADC2-IN10: R15.2 TP04.P$1(TP) ; also sheet 10
AGND: C17.2 C18.2 C19.2 C20.2 C23.2 C24.2 IC5.3(A:+IN) IC5.5(B:+IN) IC6.3(A:+IN) IC6.5(B:+IN) ; also sheet 1,3,4,5,6,7,8
L/M_OUT(VCA1_OUT): IC7.3(A:+IN) ; also sheet 3,7
N$6: D2.C IC5.2(A:-IN) R1.2 R6.1
N$9: D1.C D2.A IC5.1(A:OUT)
N$12: D1.A R4.1 R6.2
N$34: IC5.6(B:-IN) R4.2 R5.2 R13.1
N$36: IC5.7(B:OUT) R3.1 R13.2
N$42: D7.C IC6.2(A:-IN) R2.2 R31.1
N$44: D6.C D7.A IC6.1(A:OUT)
N$46: D6.A R16.1 R31.2
N$47: IC6.6(B:-IN) R16.2 R30.2 R32.1
N$48: IC6.7(B:OUT) R15.1 R32.2
NET11: IC7.1(A:OUT) IC7.2(A:-IN) R1.1 R5.1
NET22: IC7.6(B:-IN) IC7.7(B:OUT) R2.1 R30.1
R/S_OUT(VCA2_OUT): IC7.5(B:+IN) ; also sheet 3,7
V+: C18.1 C20.1 C23.1 IC5.8(P:V+) IC6.8(P:V+) IC7.8(P:V+) ; supply symbol labelled +15V ; also sheet 1,3,4,5,6,7,8
V-: C17.1 C19.1 C24.1 IC5.4(P:V-) IC6.4(P:V-) IC7.4(P:V-) ; supply symbol labelled -15V ; also sheet 1,3,4,5,6,7,8

### Notes on the sheet
- Präzisionsgleichrichter

## Sheet 10 of 10
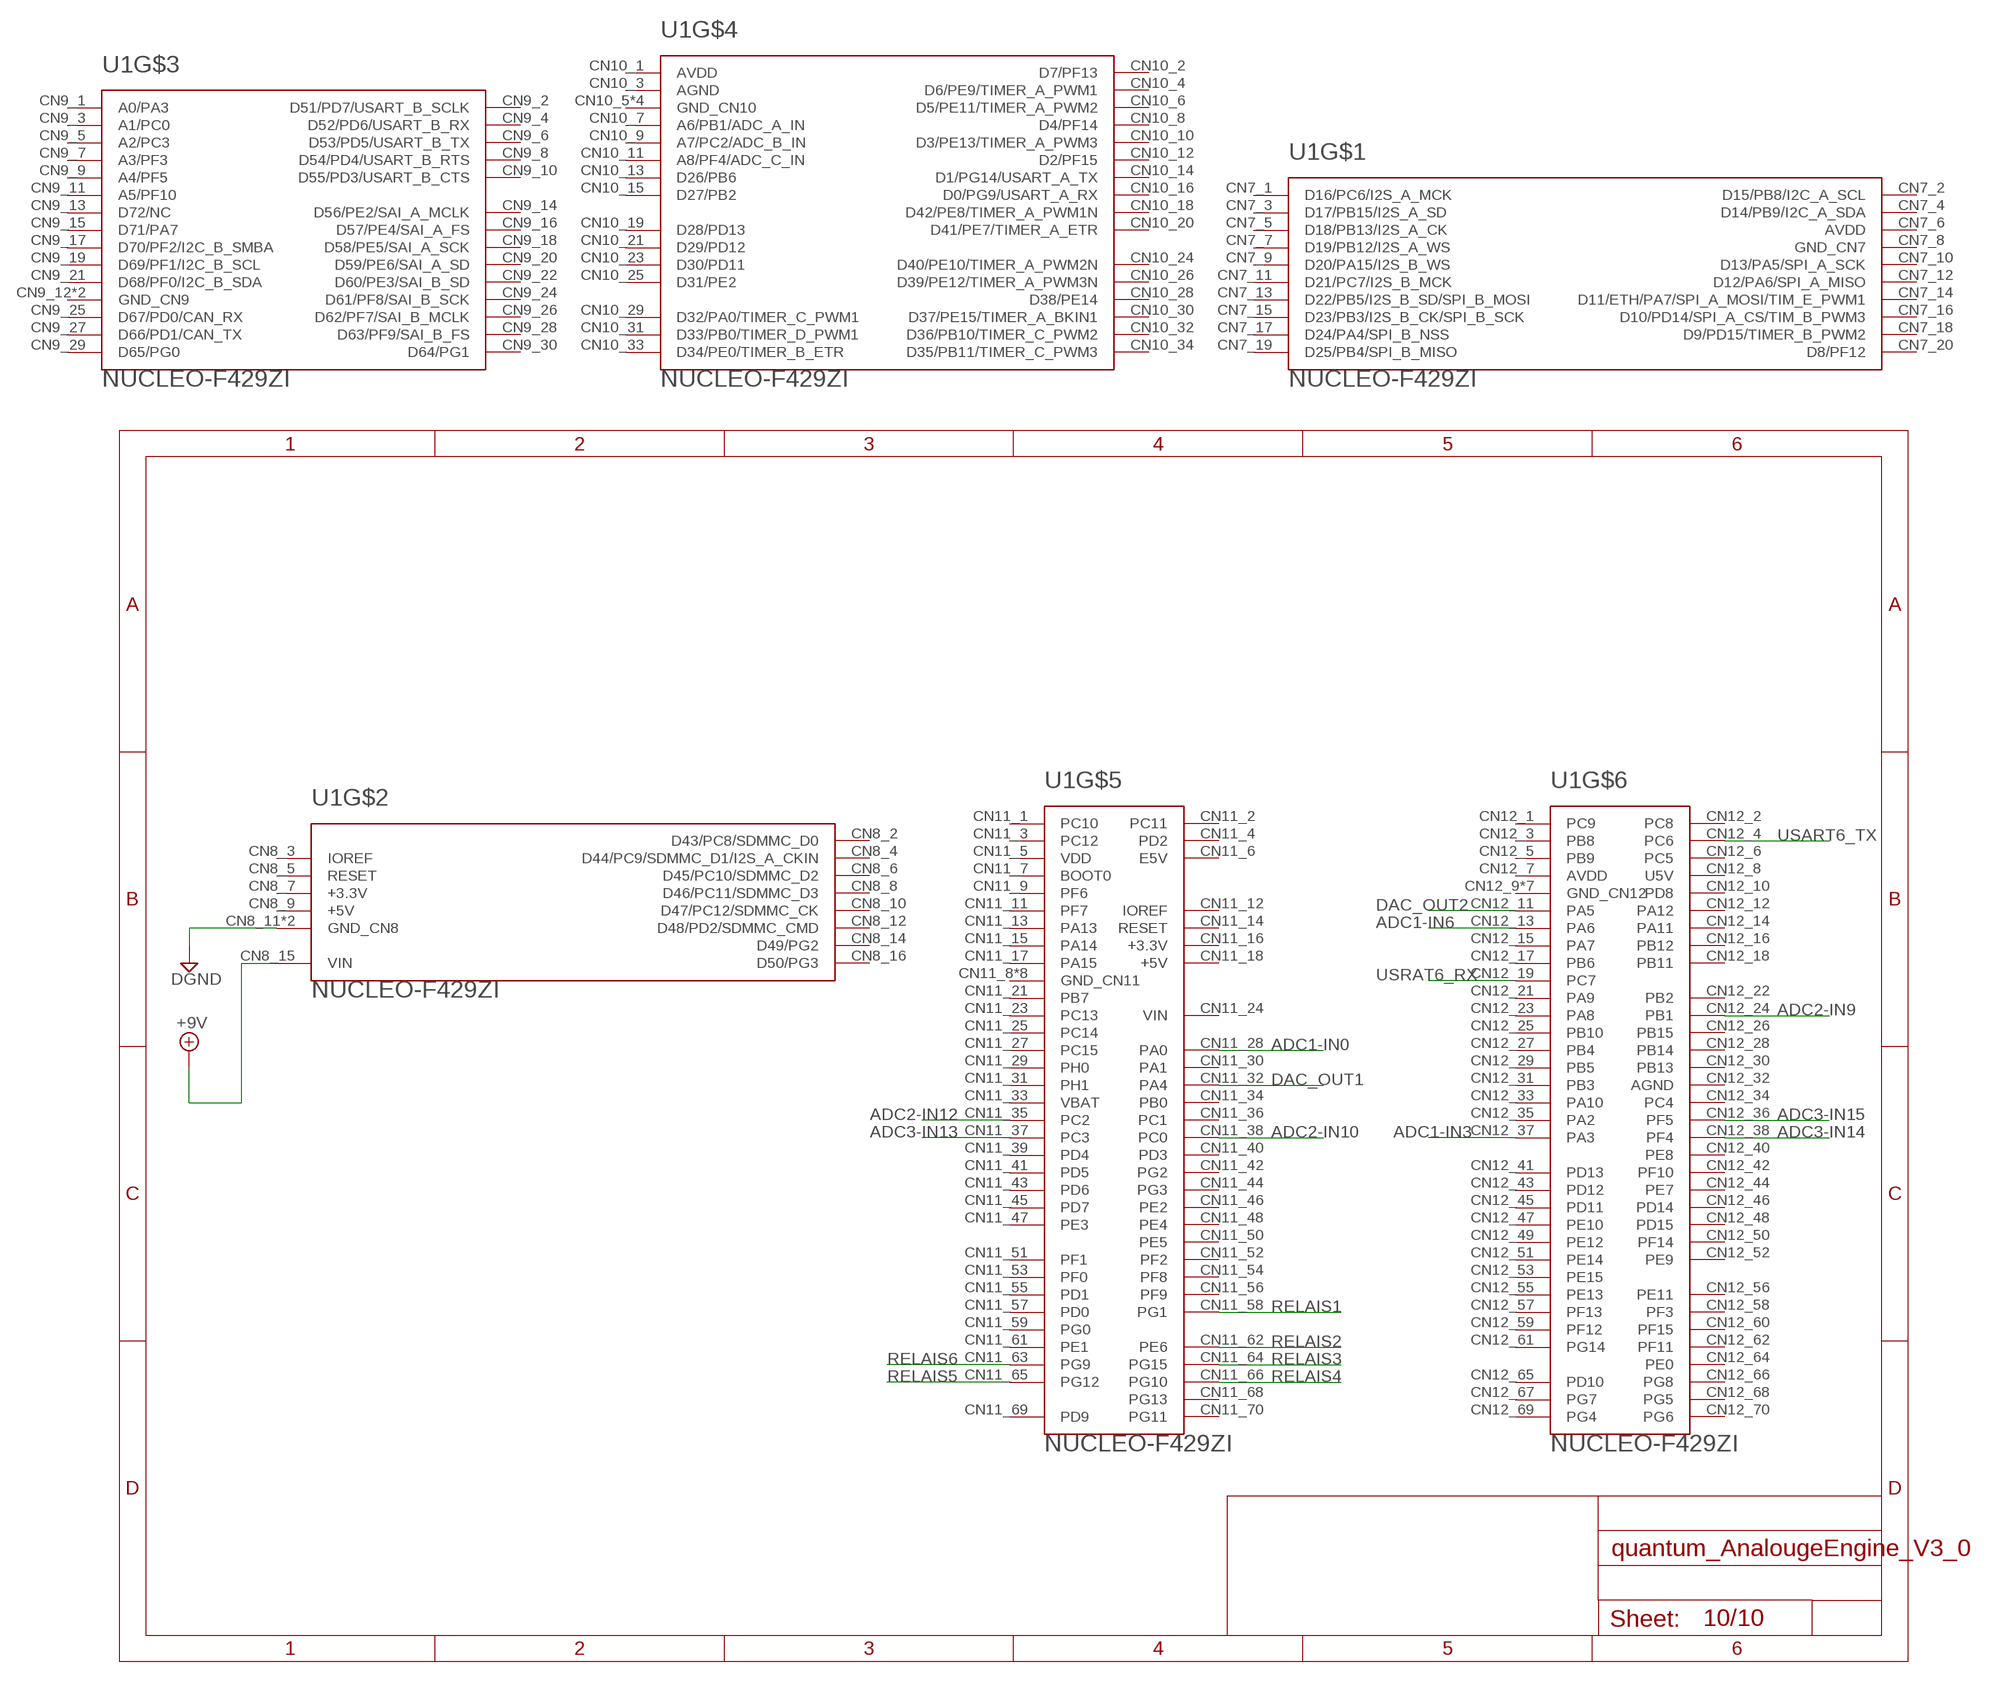
[diagram p9: schematic, sheet 10]

### Parts
U1  NUCLEO-F429ZI  [MODULE_NUCLEO-F429ZI]

### Nets
+9V: U1.CN8_15(VIN) ; also sheet 1,2
ADC1-IN0: U1.CN11_28(PA0) ; also sheet 8
ADC1-IN3: U1.CN12_37(PA3) ; also sheet 9
ADC1-IN6: U1.CN12_13(PA6)
ADC2-IN9: U1.CN12_24(PB1) ; also sheet 8
ADC2-IN10: U1.CN11_38(PC0) ; also sheet 9
ADC2-IN12: U1.CN11_35(PC2)
ADC3-IN13: U1.CN11_37(PC3)
ADC3-IN14: U1.CN12_38(PF4)
ADC3-IN15: U1.CN12_36(PF5)
DAC_OUT1: U1.CN11_32(PA4) ; also sheet 7
DAC_OUT2: U1.CN12_11(PA5) ; also sheet 7
DGND: U1.CN8_11(GND_CN8) U1.CN8_13(GND_CN8) ; also sheet 1,2
RELAIS1: U1.CN11_58(PG1) ; also sheet 2
RELAIS2: U1.CN11_62(PE6) ; also sheet 2
RELAIS3: U1.CN11_64(PG15) ; also sheet 2
RELAIS4: U1.CN11_66(PG10) ; also sheet 2
RELAIS5: U1.CN11_65(PG12) ; also sheet 2
RELAIS6: U1.CN11_63(PG9) ; also sheet 2
USART6_TX: U1.CN12_4(PC6)
USRAT6_RX: U1.CN12_19(PC7)
Unconnected: U1.CN7_1(D16/PC6/I2S_A_MCK) U1.CN7_2(D15/PB8/I2C_A_SCL) U1.CN7_3(D17/PB15/I2S_A_SD) U1.CN7_4(D14/PB9/I2C_A_SDA) U1.CN7_5(D18/PB13/I2S_A_CK) U1.CN7_6(AVDD) U1.CN7_7(D19/PB12/I2S_A_WS) U1.CN7_8(GND_CN7) U1.CN7_9(D20/PA15/I2S_B_WS) U1.CN7_10(D13/PA5/SPI_A_SCK) U1.CN7_11(D21/PC7/I2S_B_MCK) U1.CN7_12(D12/PA6/SPI_A_MISO) U1.CN7_13(D22/PB5/I2S_B_SD/SPI_B_MOSI) U1.CN7_14(D11/ETH/PA7/SPI_A_MOSI/TIM_E_PWM1) U1.CN7_15(D23/PB3/I2S_B_CK/SPI_B_SCK) U1.CN7_16(D10/PD14/SPI_A_CS/TIM_B_PWM3) U1.CN7_17(D24/PA4/SPI_B_NSS) U1.CN7_18(D9/PD15/TIMER_B_PWM2) U1.CN7_19(D25/PB4/SPI_B_MISO) U1.CN7_20(D8/PF12) U1.CN8_2(D43/PC8/SDMMC_D0) U1.CN8_3(IOREF) U1.CN8_4(D44/PC9/SDMMC_D1/I2S_A_CKIN) U1.CN8_5(RESET) U1.CN8_6(D45/PC10/SDMMC_D2) U1.CN8_7(+3.3V) U1.CN8_8(D46/PC11/SDMMC_D3) U1.CN8_9(+5V) U1.CN8_10(D47/PC12/SDMMC_CK) U1.CN8_12(D48/PD2/SDMMC_CMD) U1.CN8_14(D49/PG2) U1.CN8_16(D50/PG3) U1.CN9_1(A0/PA3) U1.CN9_2(D51/PD7/USART_B_SCLK) U1.CN9_3(A1/PC0) U1.CN9_4(D52/PD6/USART_B_RX) U1.CN9_5(A2/PC3) U1.CN9_6(D53/PD5/USART_B_TX) U1.CN9_7(A3/PF3) U1.CN9_8(D54/PD4/USART_B_RTS) U1.CN9_9(A4/PF5) U1.CN9_10(D55/PD3/USART_B_CTS) U1.CN9_11(A5/PF10) U1.CN9_12(GND_CN9) U1.CN9_13(D72/NC) U1.CN9_14(D56/PE2/SAI_A_MCLK) U1.CN9_15(D71/PA7) U1.CN9_16(D57/PE4/SAI_A_FS) U1.CN9_17(D70/PF2/I2C_B_SMBA) U1.CN9_18(D58/PE5/SAI_A_SCK) U1.CN9_19(D69/PF1/I2C_B_SCL) U1.CN9_20(D59/PE6/SAI_A_SD) U1.CN9_21(D68/PF0/I2C_B_SDA) U1.CN9_22(D60/PE3/SAI_B_SD) U1.CN9_23(GND_CN9) U1.CN9_24(D61/PF8/SAI_B_SCK) U1.CN9_25(D67/PD0/CAN_RX) U1.CN9_26(D62/PF7/SAI_B_MCLK) U1.CN9_27(D66/PD1/CAN_TX) U1.CN9_28(D63/PF9/SAI_B_FS) U1.CN9_29(D65/PG0) U1.CN9_30(D64/PG1) U1.CN10_1(AVDD) U1.CN10_2(D7/PF13) U1.CN10_3(AGND) U1.CN10_4(D6/PE9/TIMER_A_PWM1) U1.CN10_5(GND_CN10) U1.CN10_6(D5/PE11/TIMER_A_PWM2) U1.CN10_7(A6/PB1/ADC_A_IN) U1.CN10_8(D4/PF14) U1.CN10_9(A7/PC2/ADC_B_IN) U1.CN10_10(D3/PE13/TIMER_A_PWM3) U1.CN10_11(A8/PF4/ADC_C_IN) U1.CN10_12(D2/PF15) U1.CN10_13(D26/PB6) U1.CN10_14(D1/PG14/USART_A_TX) U1.CN10_15(D27/PB2) U1.CN10_16(D0/PG9/USART_A_RX) U1.CN10_17(GND_CN10) U1.CN10_18(D42/PE8/TIMER_A_PWM1N) U1.CN10_19(D28/PD13) U1.CN10_20(D41/PE7/TIMER_A_ETR) U1.CN10_21(D29/PD12) U1.CN10_22(GND_CN10) U1.CN10_23(D30/PD11) U1.CN10_24(D40/PE10/TIMER_A_PWM2N) U1.CN10_25(D31/PE2) U1.CN10_26(D39/PE12/TIMER_A_PWM3N) U1.CN10_27(GND_CN10) U1.CN10_28(D38/PE14) U1.CN10_29(D32/PA0/TIMER_C_PWM1) U1.CN10_30(D37/PE15/TIMER_A_BKIN1) U1.CN10_31(D33/PB0/TIMER_D_PWM1) U1.CN10_32(D36/PB10/TIMER_C_PWM2) U1.CN10_33(D34/PE0/TIMER_B_ETR) U1.CN10_34(D35/PB11/TIMER_C_PWM3) U1.CN11_1(PC10) U1.CN11_2(PC11) U1.CN11_3(PC12) U1.CN11_4(PD2) U1.CN11_5(VDD) U1.CN11_6(E5V) U1.CN11_7(BOOT0) U1.CN11_8(GND_CN11) U1.CN11_9(PF6) U1.CN11_11(PF7) U1.CN11_12(IOREF) U1.CN11_13(PA13) U1.CN11_14(RESET) U1.CN11_15(PA14) U1.CN11_16(+3.3V) U1.CN11_17(PA15) U1.CN11_18(+5V) U1.CN11_19(GND_CN11) U1.CN11_20(GND_CN11) U1.CN11_21(PB7) U1.CN11_22(GND_CN11) U1.CN11_23(PC13) U1.CN11_24(VIN) U1.CN11_25(PC14) U1.CN11_27(PC15) U1.CN11_29(PH0) U1.CN11_30(PA1) U1.CN11_31(PH1) U1.CN11_33(VBAT) U1.CN11_34(PB0) U1.CN11_36(PC1) U1.CN11_39(PD4) U1.CN11_40(PD3) U1.CN11_41(PD5) U1.CN11_42(PG2) U1.CN11_43(PD6) U1.CN11_44(PG3) U1.CN11_45(PD7) U1.CN11_46(PE2) U1.CN11_47(PE3) U1.CN11_48(PE4) U1.CN11_49(GND_CN11) U1.CN11_50(PE5) U1.CN11_51(PF1) U1.CN11_52(PF2) U1.CN11_53(PF0) U1.CN11_54(PF8) U1.CN11_55(PD1) U1.CN11_56(PF9) U1.CN11_57(PD0) U1.CN11_59(PG0) U1.CN11_60(GND_CN11) U1.CN11_61(PE1) U1.CN11_68(PG13) U1.CN11_69(PD9) U1.CN11_70(PG11) U1.CN11_71(GND_CN11) U1.CN11_72(GND_CN11) U1.CN12_1(PC9) U1.CN12_2(PC8) U1.CN12_3(PB8) U1.CN12_5(PB9) U1.CN12_6(PC5) U1.CN12_7(AVDD) U1.CN12_8(U5V) U1.CN12_9(GND_CN12) U1.CN12_10(PD8) U1.CN12_12(PA12) U1.CN12_14(PA11) U1.CN12_15(PA7) U1.CN12_16(PB12) U1.CN12_17(PB6) U1.CN12_18(PB11) U1.CN12_20(GND_CN12) U1.CN12_21(PA9) U1.CN12_22(PB2) U1.CN12_23(PA8) U1.CN12_25(PB10) U1.CN12_26(PB15) U1.CN12_27(PB4) U1.CN12_28(PB14) U1.CN12_29(PB5) U1.CN12_30(PB13) U1.CN12_31(PB3) U1.CN12_32(AGND) U1.CN12_33(PA10) U1.CN12_34(PC4) U1.CN12_35(PA2) U1.CN12_39(GND_CN12) U1.CN12_40(PE8) U1.CN12_41(PD13) U1.CN12_42(PF10) U1.CN12_43(PD12) U1.CN12_44(PE7) U1.CN12_45(PD11) U1.CN12_46(PD14) U1.CN12_47(PE10) U1.CN12_48(PD15) U1.CN12_49(PE12) U1.CN12_50(PF14) U1.CN12_51(PE14) U1.CN12_52(PE9) U1.CN12_53(PE15) U1.CN12_54(GND_CN12) U1.CN12_55(PE13) U1.CN12_56(PE11) U1.CN12_57(PF13) U1.CN12_58(PF3) U1.CN12_59(PF12) U1.CN12_60(PF15) U1.CN12_61(PG14) U1.CN12_62(PF11) U1.CN12_63(GND_CN12) U1.CN12_64(PE0) U1.CN12_65(PD10) U1.CN12_66(PG8) U1.CN12_67(PG7) U1.CN12_68(PG5) U1.CN12_69(PG4) U1.CN12_70(PG6) U1.CN12_71(GND_CN12) U1.CN12_72(GND_CN12)

## Library data of the parts
+15VOK -15VOK L1-L8 = C_Sager_Bibliothek:SMD_LED_0603: SMD LED 0603
BY_1_1 BY_1_2 BY_2_1 BY_2_2 K5-K8 = C_Sager_Bibliothek:RELAY_EE2-5NU: RELAY SPST; OC_FARNELL: unknown; OC_NEWARK: unknown
C1-C32 C53-C64 U$2 U$3 = C_Sager_Bibliothek:CAPACITOR: capacitor
C67-C70 = C_Sager_Bibliothek:SMD_ELCTROLYTIC: SMD Elektrolyt Kondensator 153CLV-0605
CONN3 = C_Sager_Bibliothek:SCHRAUBKLEMME_3POL: WAGO SCREW CLAMP; MPN: 237-103; OC_FARNELL: unknown; OC_NEWARK: 18M7116
D1-D8 = C_Sager_Bibliothek:4148: Standard 4148 Diode SOD323 Format
IC1 IC4 IC8 = C_Sager_Bibliothek:OP275: Dual Very Low Noise Precision Operational Amplifier Source: http://www.analog.com/static/imported-files/data_sheets/OP270.pdf
IC2 IC3 IC5-IC7 IC10 = linear:NE5532: AUDIO AMPLIFIER; SPICEPREFIX: Z
IC9 = C_Sager_Bibliothek:TL072
IN1(R/S) IN2(L/M) = C_Sager_Bibliothek:NEUTRIK_NC3FAH
IN_LEFT IN_RIGHT U4 U6-U8 = THAT_Library:THAT1240: Balanced Line Receiver THAT1240, THAT1243, THAT1246
OUT1(R/S) OUT2(L/M) = C_Sager_Bibliothek:NEUTRIK_NC3MAH
OUT_LEFT OUT_RIGHT = THAT_Library:THAT1646: Outsmarts Balanced Line Driver
R1 R17 = C_Sager_Bibliothek:RESISTOR: +/- 5 % resistor; SPICEPREFIX: R
R2-R16 R18-R35 R48-R62 R67 = C_Sager_Bibliothek:RESISTOR: +/- 5 % resistor
TP01-TP06 TP09 TP16 TP18 TP23 TP36 TP37 = C_Sager_Bibliothek:TP
U1 = STM32_144:NUCLEO-F429ZI: STM32 Nucleo-144 development board with STM32F429ZIT6 MCU, supports Arduino, ST Zio and Morpho; AVAILABILITY: Unavailable; DESCRIPTION: STM32 Nucleo-144 development board with STM32F429ZIT6 MCU, supports Arduino, ST Zio and Morpho; MF: STMicroelectronics; MP: NUCLEO-F429ZI; PACKAGE: None; PRICE: None
U12 = C_Sager_Bibliothek:ULN2003
U$1 = C_Sager_Bibliothek:78**
VCA1(LEFT) VCA2(RIGHT) = THAT_Library:THAT2181: VCA Trimmable IC